# EAGLE schematic ACB-R1.0-43-CH09 (EAGLE 8.6.3)
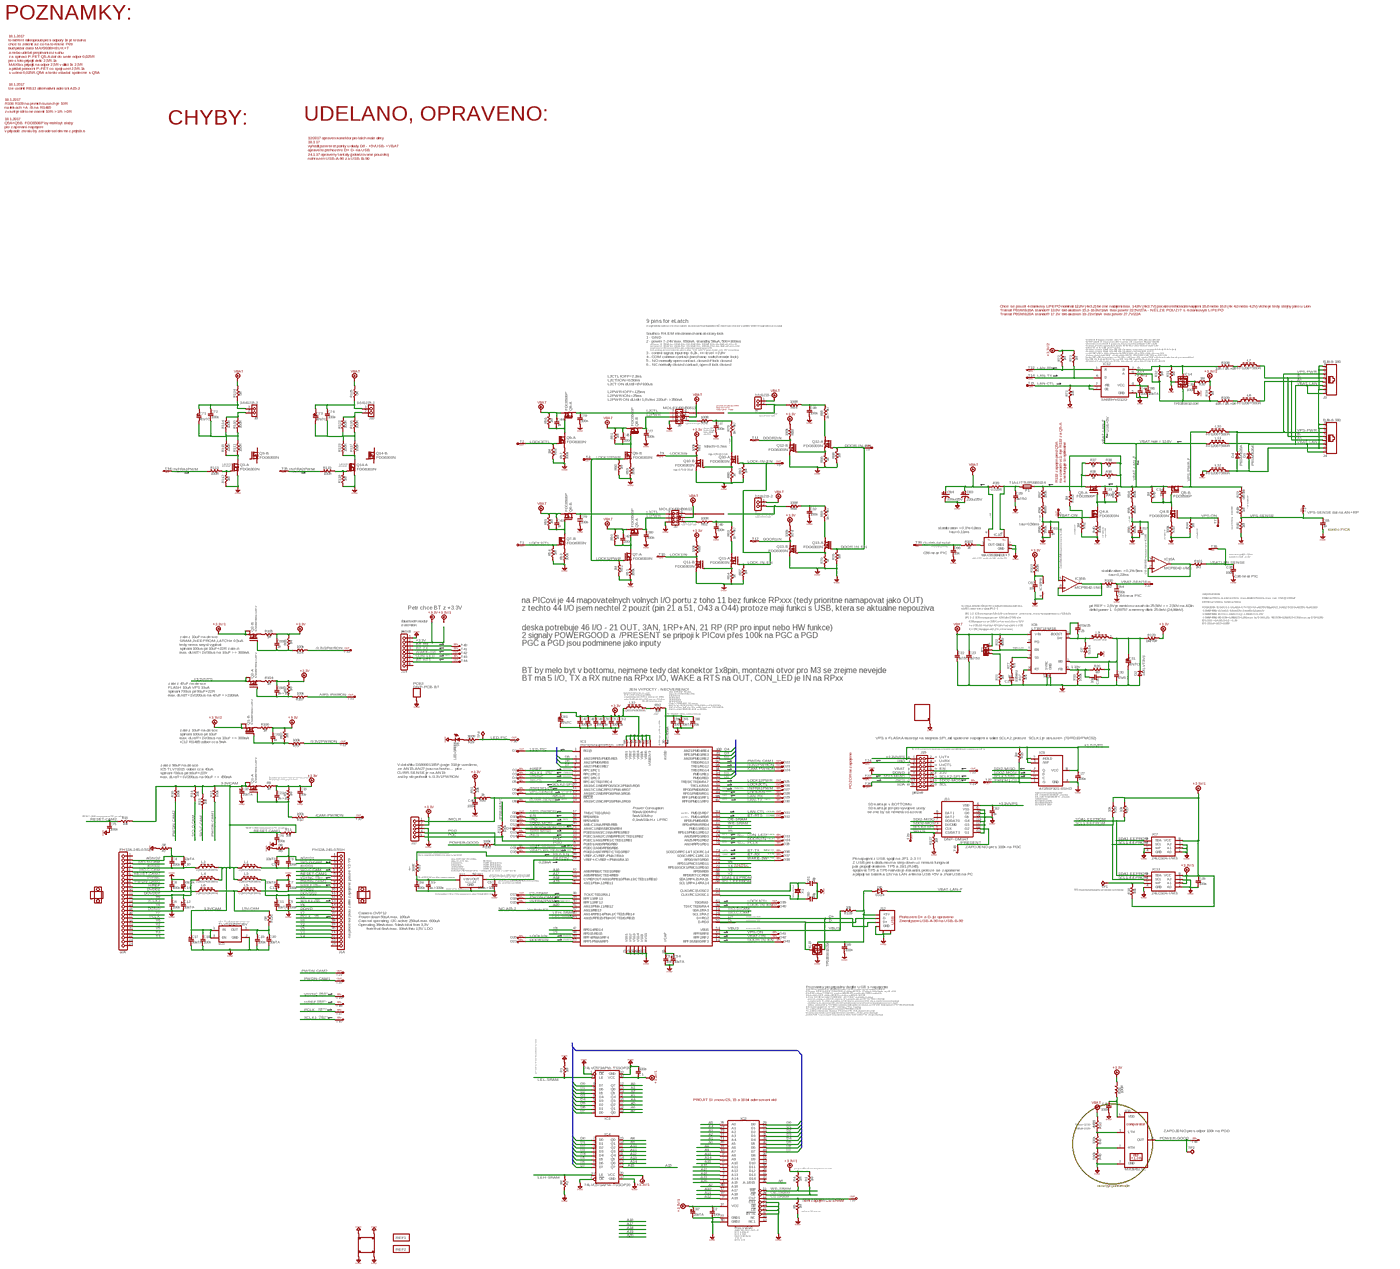
[diagram p0: schematic, sheet 1, overview]
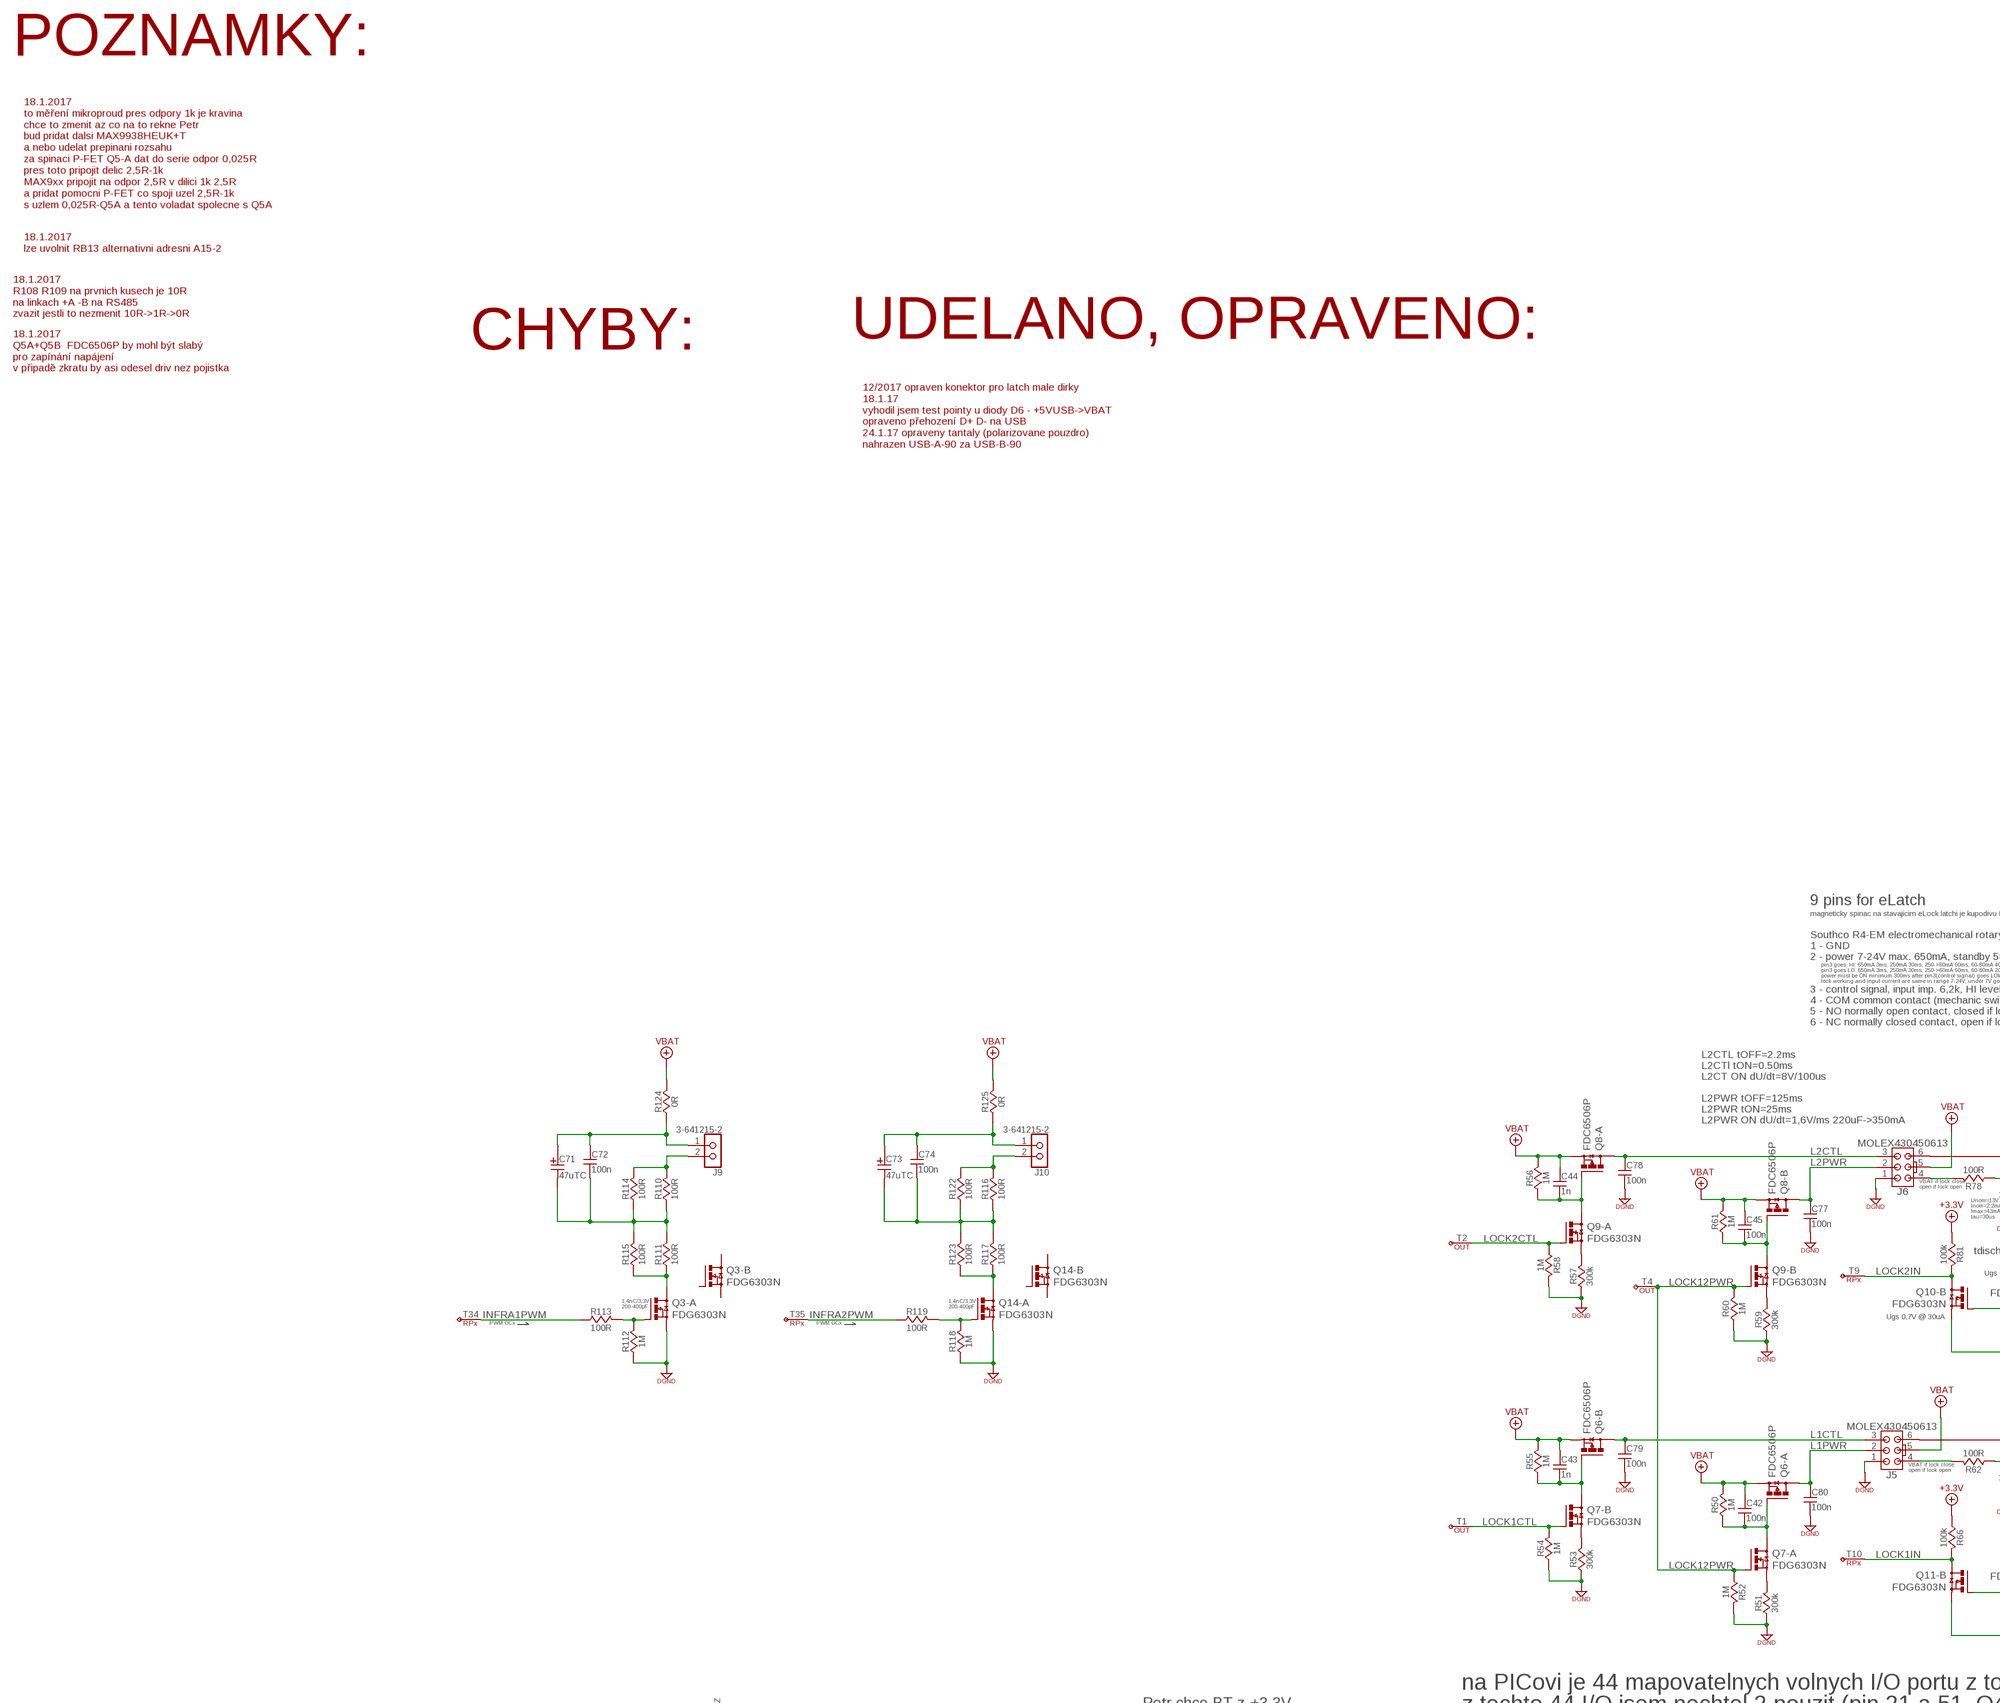
[diagram p1: schematic, sheet 1, part 1 of 4]
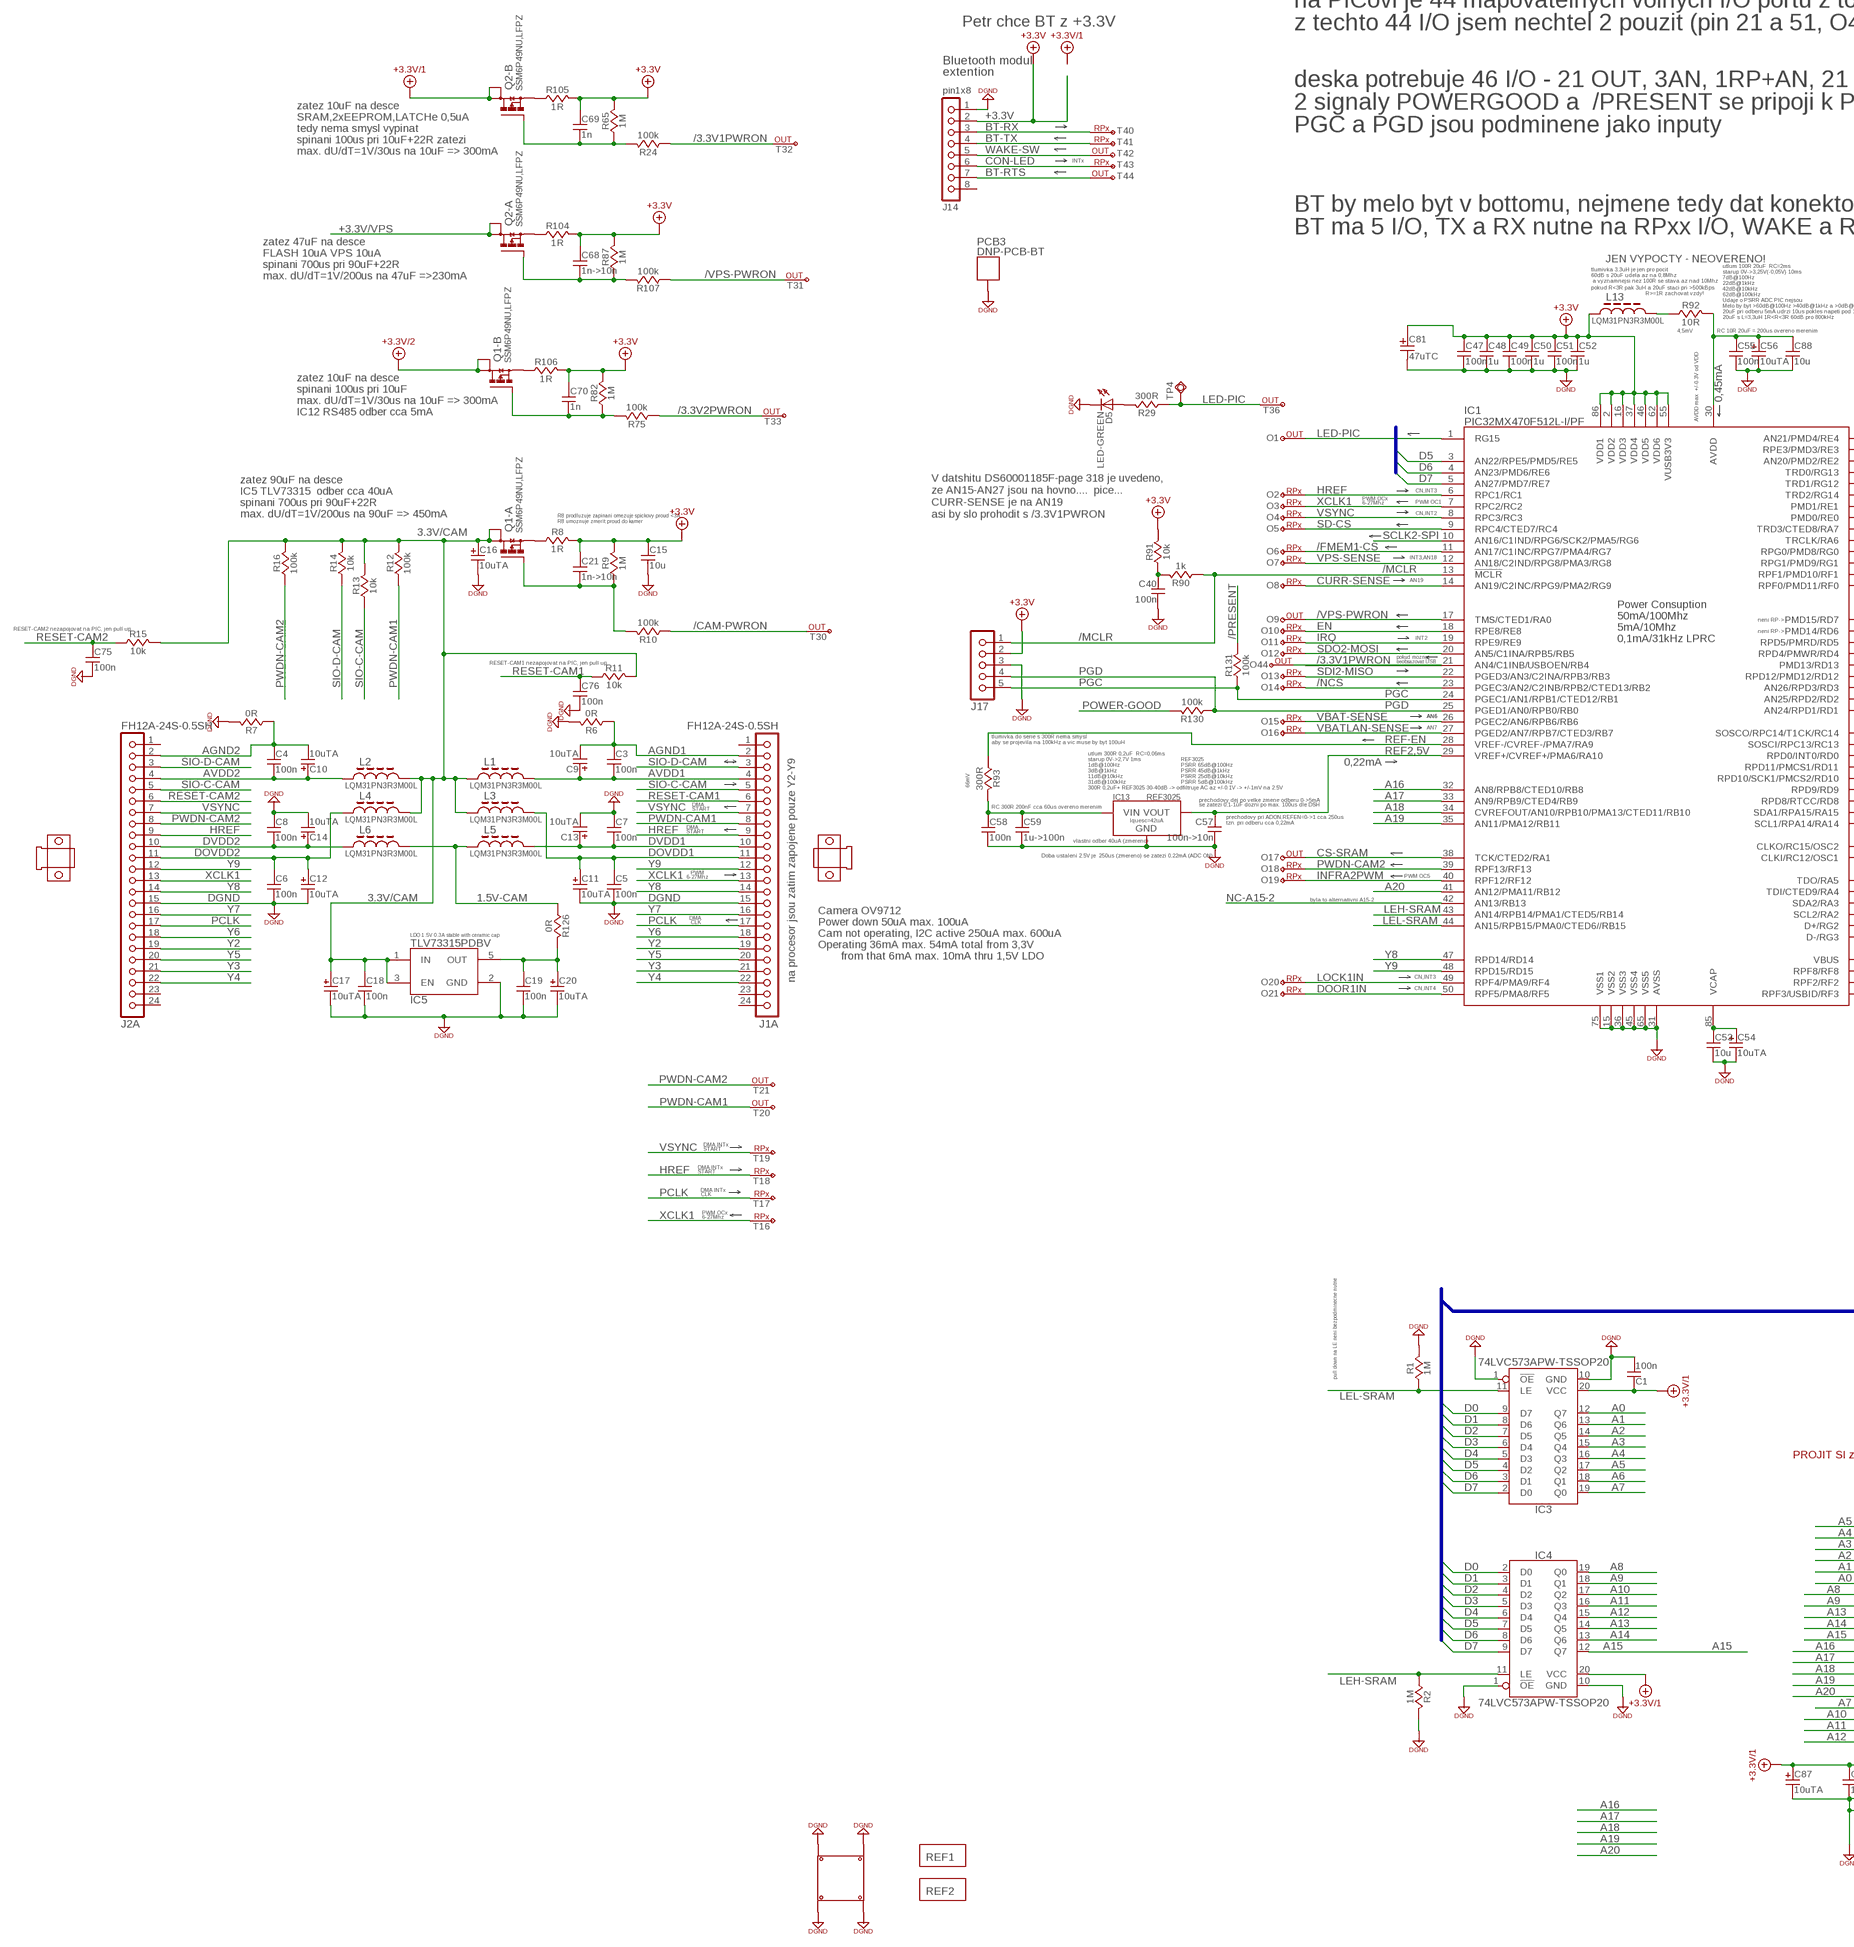
[diagram p2: schematic, sheet 1, part 2 of 4]
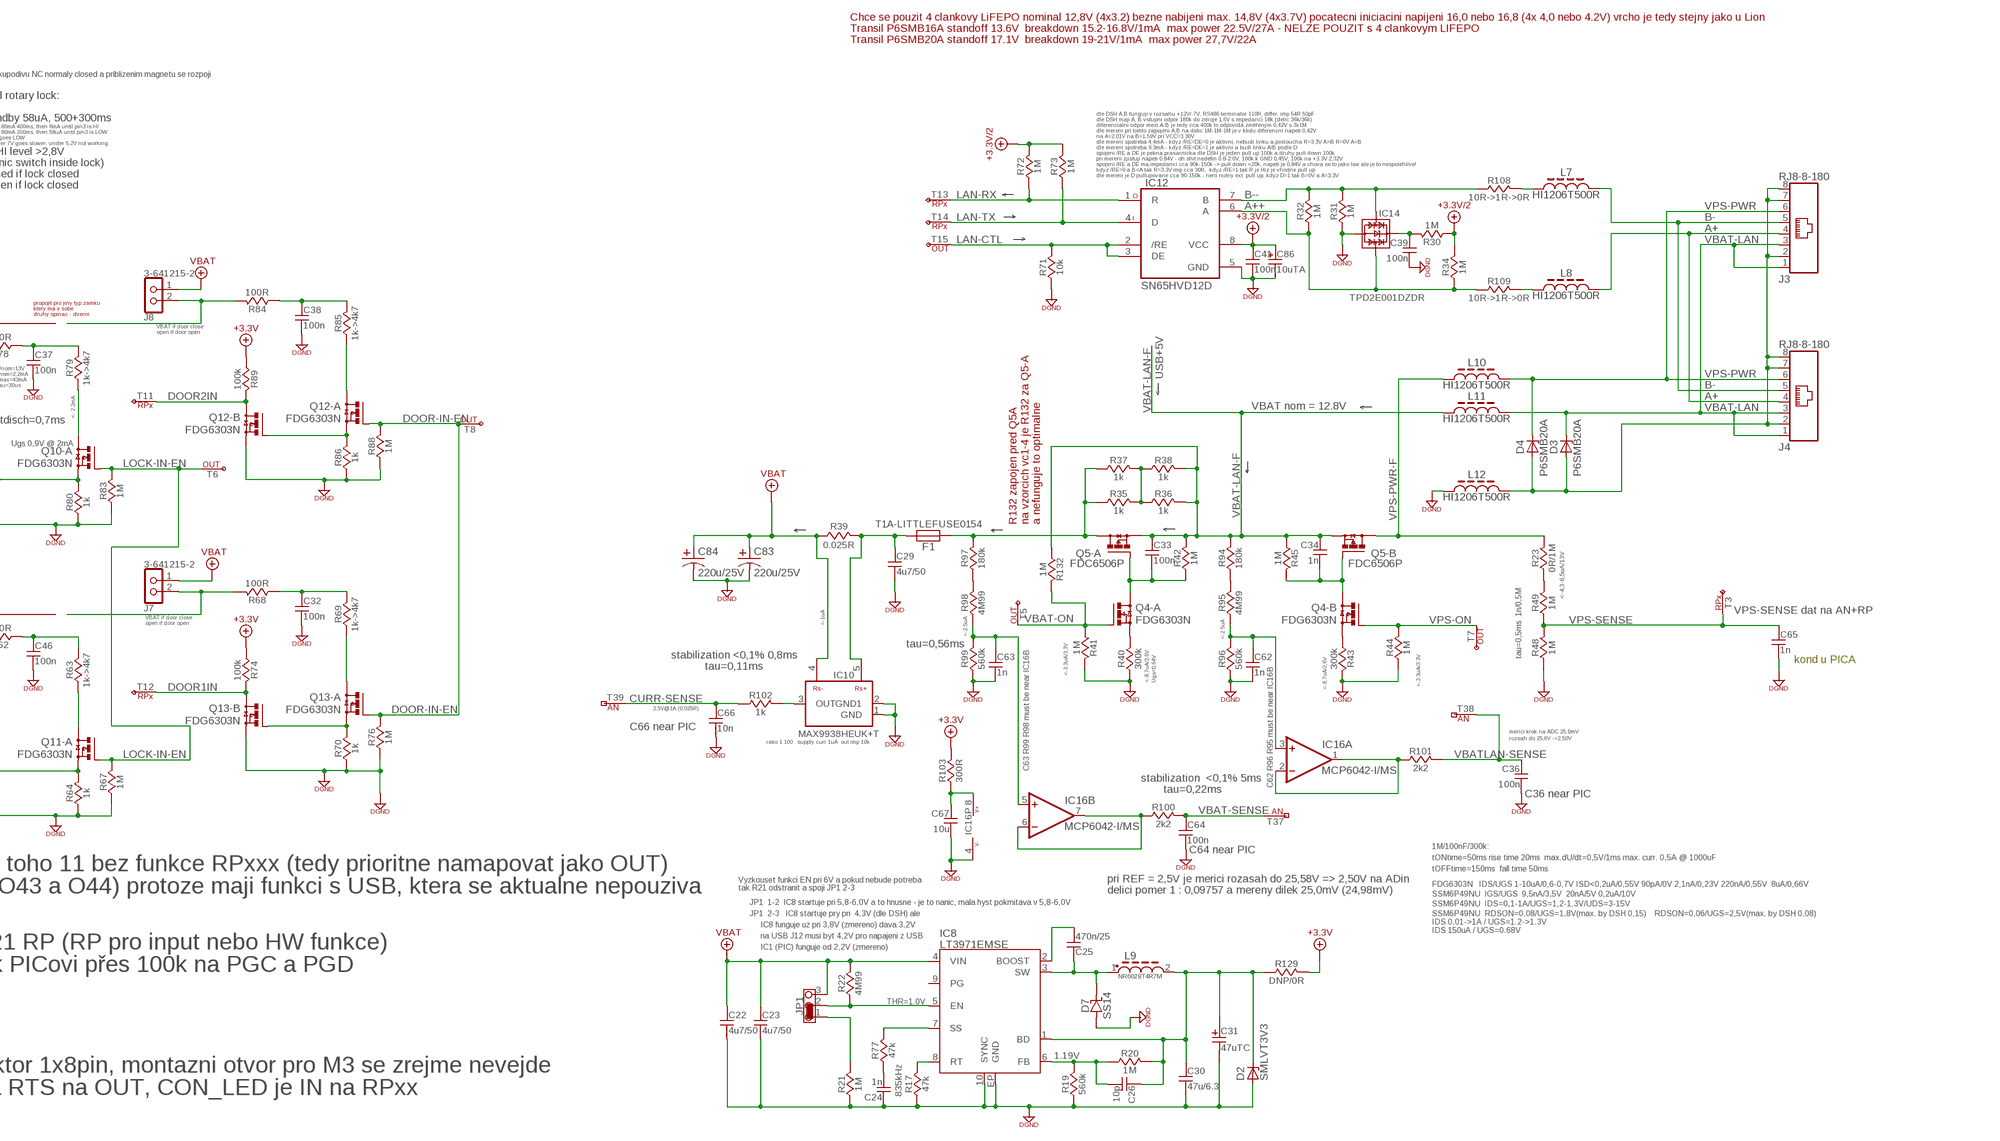
[diagram p3: schematic, sheet 1, part 3 of 4]
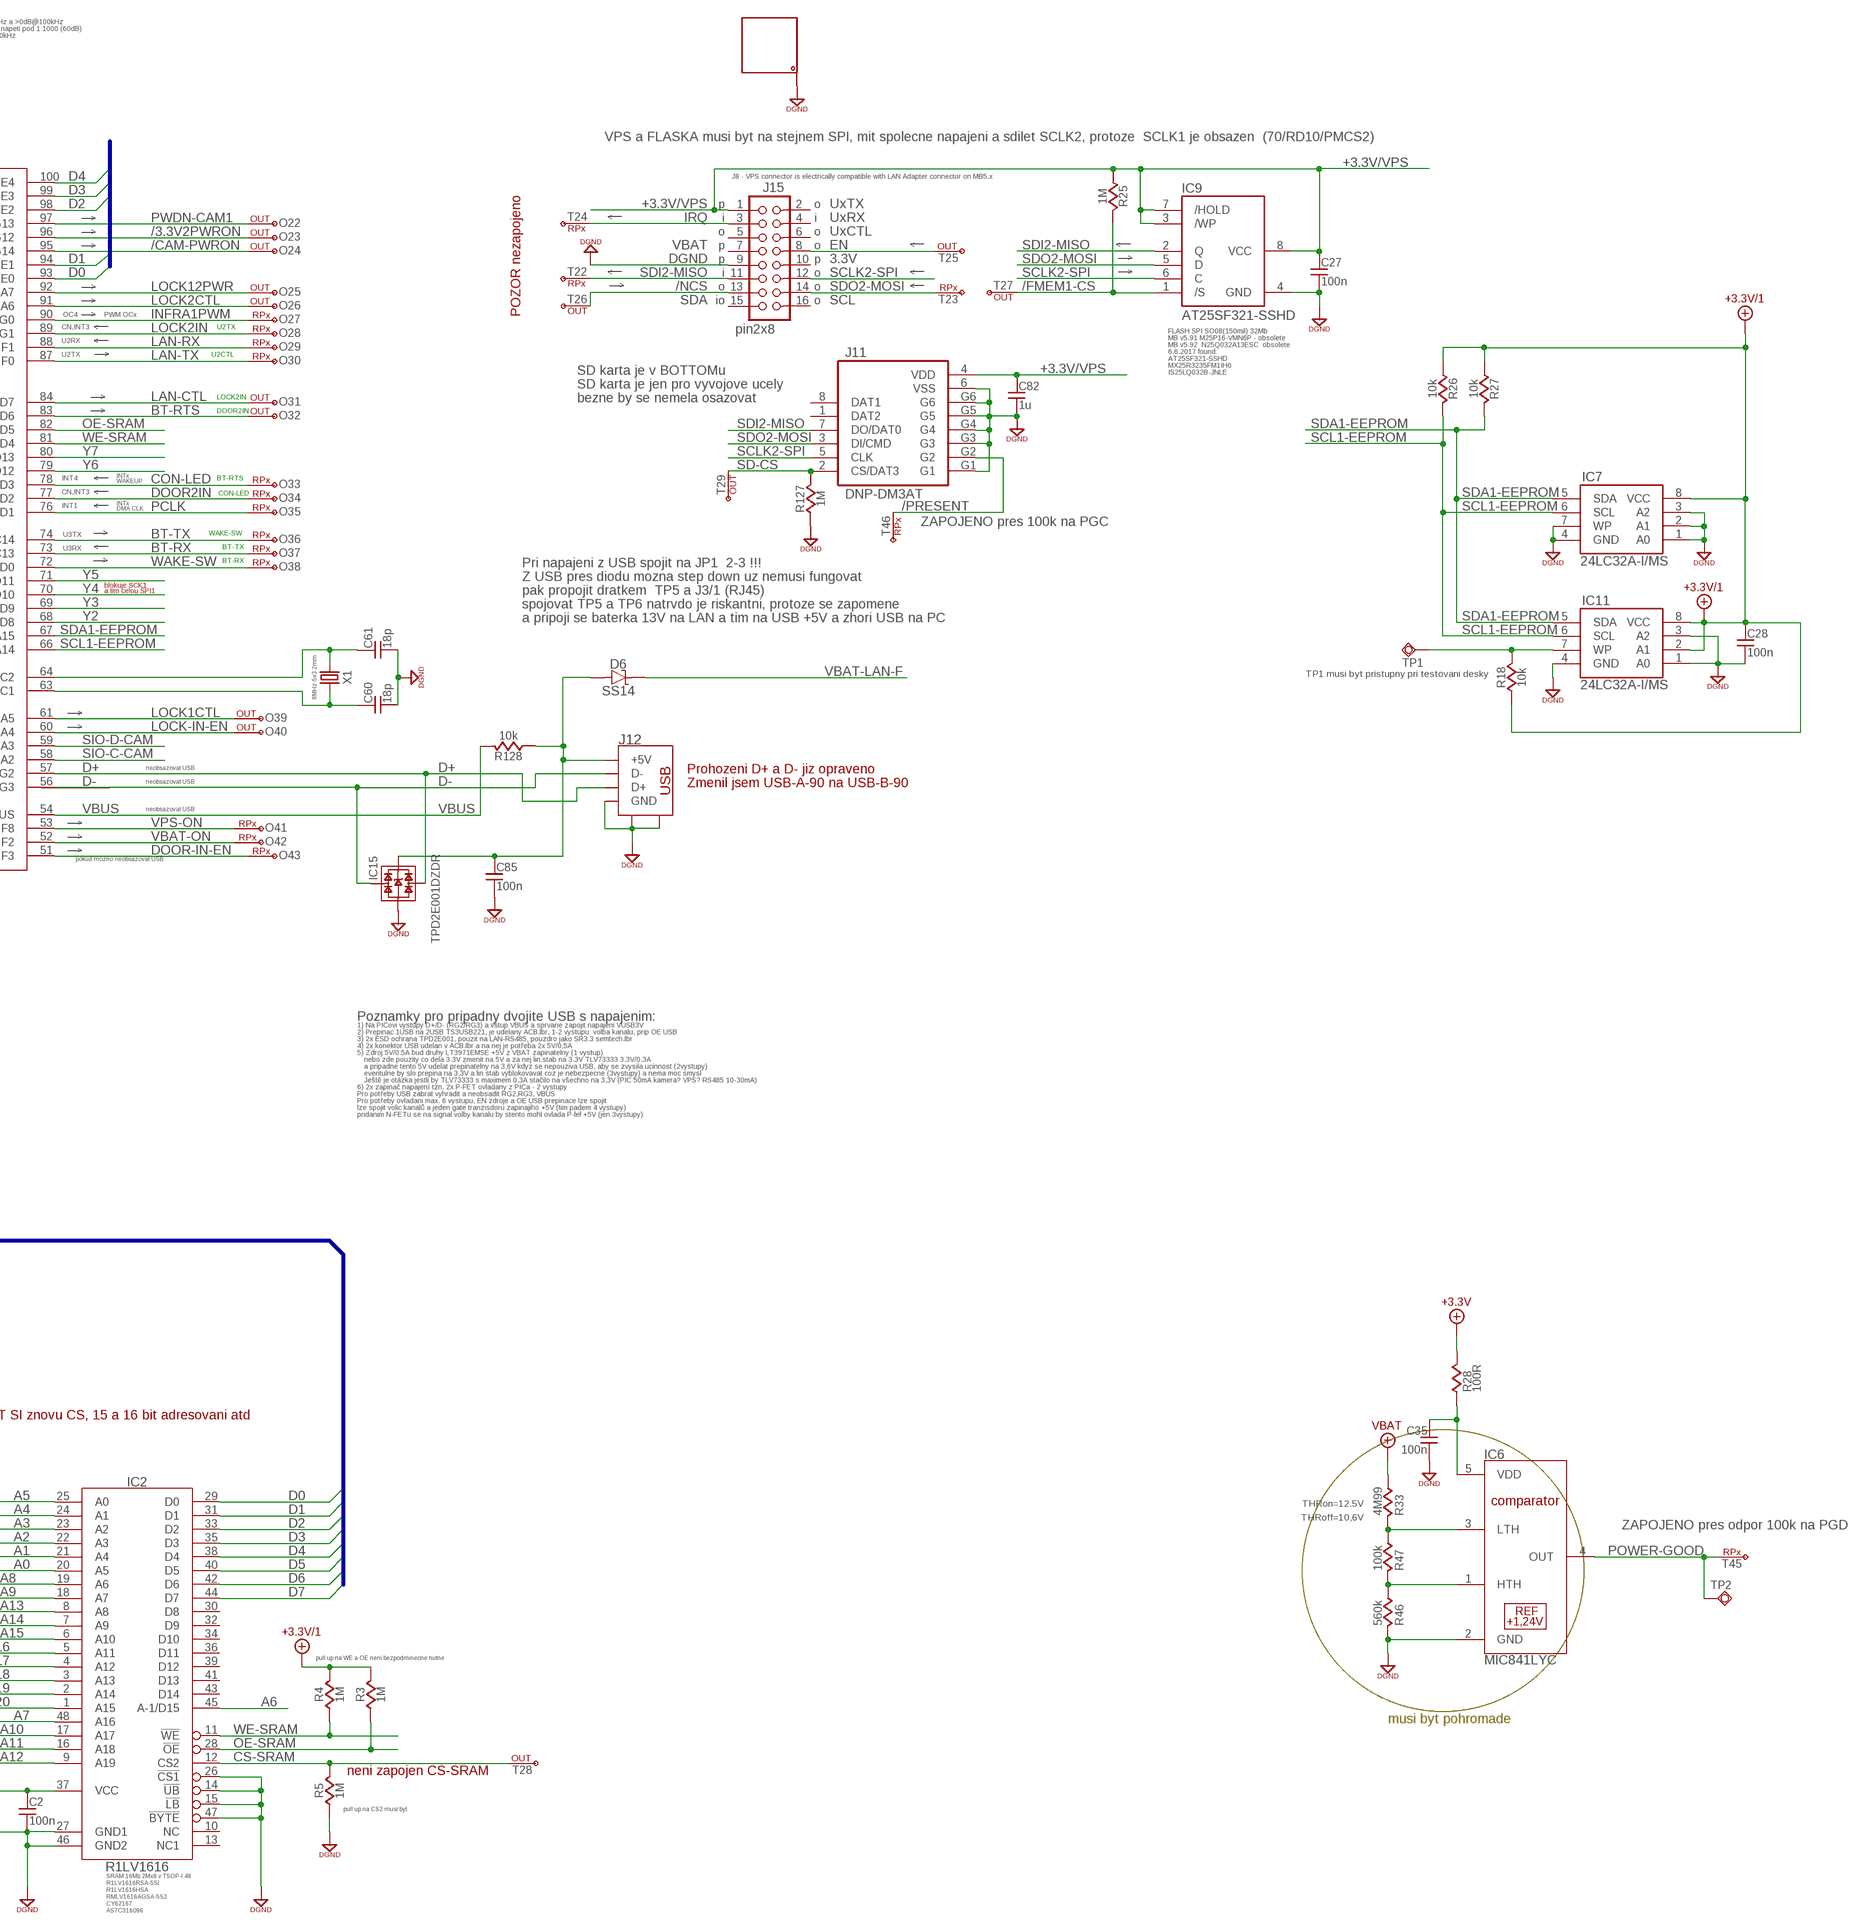
[diagram p4: schematic, sheet 1, part 4 of 4]

## Parts
C1  100n  C-0603  [0603]
C2  100n  C-0603  [0603]
C3  100n  C-0603  [0603]
C4  100n  C-0603  [0603]
C5  100n  C-0603  [0603]
C6  100n  C-0603  [0603]
C7  100n  C-0603  [0603]
C8  100n  C-0603  [0603]
C9  10uTA  CT-1206  [1206-POL-C]
C10  10uTA  CT-1206  [1206-POL-C]
C11  10uTA  CT-1206  [1206-POL-C]
C12  10uTA  CT-1206  [1206-POL-C]
C13  10uTA  CT-1206  [1206-POL-C]
C14  10uTA  CT-1206  [1206-POL-C]
C15  10u  C-0603  [0603]
C16  10uTA  CT-1206  [1206-POL-C]
C17  10uTA  CT-1206  [1206-POL-C]
C18  100n  C-0603  [0603]
C19  100n  C-0603  [0603]
C20  10uTA  CT-1206  [1206-POL-C]
C21  1n->10n  C-0603  [0603]
C22  4u7/50  C-1206  [1206]
C23  4u7/50  C-1206  [1206]
C24  1n  C-0603  [0603]
C25  470n/25  C-0603  [0603]
C26  10p  C-0603  [0603]
C27  100n  C-0603  [0603]
C28  100n  C-0603  [0603]
C29  4u7/50  C-1206  [1206]
C30  47u/6.3  C-1206  [1206]
C31  47uTC  CT-C  [CT-C]
C32  100n  C-0603  [0603]
C33  100n  C-0603  [0603]
C34  1n  C-0603  [0603]
C35  100n  C-0603  [0603]
C36  100n  C-0603  [0603]
C37  100n  C-0603  [0603]
C38  100n  C-0603  [0603]
C39  100n  C-0603  [0603]
C40  100n  C-0603  [0603]
C41  100n  C-0603  [0603]
C42  100n  C-0603  [0603]
C43  1n  C-0603  [0603]
C44  1n  C-0603  [0603]
C45  100n  C-0603  [0603]
C46  100n  C-0603  [0603]
C47  100n  C-0603  [0603]
C48  1u  C-0603  [0603]
C49  100n  C-0603  [0603]
C50  1u  C-0603  [0603]
C51  100n  C-0603  [0603]
C52  1u  C-0603  [0603]
C53  10u  C-0603  [0603]
C54  10uTA  CT-1206  [1206-POL-C]
C55  100n  C-0603  [0603]
C56  10uTA  CT-1206  [1206-POL-C]
C57  100n->10n  C-0603  [0603]
C58  100n  C-0603  [0603]
C59  1u->100n  C-0603  [0603]
C60  18p  C-0603  [0603]
C61  18p  C-0603  [0603]
C62  1n  C-0603  [0603]
C63  1n  C-0603  [0603]
C64  100n  C-0603  [0603]
C65  1n  C-0603  [0603]
C66  10n  C-0603  [0603]
C67  10u  C-0603  [0603]
C68  1n->10n  C-0603  [0603]
C69  1n  C-0603  [0603]
C70  1n  C-0603  [0603]
C71  47uTC  CT-C  [CT-C]
C72  100n  C-0603  [0603]
C73  47uTC  CT-C  [CT-C]
C74  100n  C-0603  [0603]
C75  100n  C-0603  [0603]
C76  100n  C-0603  [0603]
C77  100n  C-0603  [0603]
C78  100n  C-0603  [0603]
C79  100n  C-0603  [0603]
C80  100n  C-0603  [0603]
C81  47uTC  CT-C  [CT-C]
C82  1u  C-0603  [0603]
C83  220u/25V  CAP-ELEC-SMD-8MM  [CAP_8MM_DIA_SMT]
C84  220u/25V  CAP-ELEC-SMD-8MM  [CAP_8MM_DIA_SMT]
C85  100n  C-0603  [0603]
C86  10uTA  CT-1206  [1206-POL-C]
C87  10uTA  CT-1206  [1206-POL-C]
C88  10u  C-0603  [0603]
D2  SMLVT3V3  [SMA]
D3  P6SMB20A  P6SMB  [SMB]
D4  P6SMB20A  P6SMB  [SMB]
D5  LED-GREEN  LED-0805  [0805-POL-D]
D6  SS14  DS-SMA  [SMA]
D7  SS14  DS-SMA  [SMA]
F1  T1A-LITTLEFUSE0154  POJISTKA-LITTLEFUSE0154  [LITTLEFUSE0154]
H1  CAM-HOLDER  [CAM-HOLDER]
H2  CAM-HOLDER  [CAM-HOLDER]
IC1  PIC32MX470F512L-I/PF  [TQFP100_14X14_0,5MM]
IC2  R1LV1616  R1LV1616HSA  [48-TSOP-I]
IC3  74LVC573APW-TSSOP20  [TSSOP20]
IC4  74LVC573APW-TSSOP20  [TSSOP20]
IC5  TLV73315PDBV  [SOT23-5]
IC6  MIC841LYC  [SC-70-5]
IC7  24LC32A-I/MS  24-I/MS  [MSOP-08]
IC8  LT3971EMSE  [MSOP10EXP]
IC9  AT25SF321-SSHD  M25P16-VMN6P  [SO-08]
IC10  MAX9938HEUK+T  TSM9938HEUK+T  [SOT23-5]
IC11  24LC32A-I/MS  24-I/MS  [MSOP-08]
IC12  SN65HVD12D  SN65HVD3082ED  [SO08]
IC13  REF3025  [SOT23]
IC14  TPD2E001DZDR  SR05.TCT  [SOT-143]
IC15  TPD2E001DZDR  SR05.TCT  [SOT-143]
IC16  MCP6042-I/MS  [MSOP-08]
J1  FH12A-24S-0.5SH  [FH12A-24S-05SH]
J2  FH12A-24S-0.5SH  [FH12A-24S-05SH]
J3  RJ8-8-180  [RJ8-8-180]
J4  RJ8-8-180  [RJ8-8-180]
J5  MOLEX430450613  [MOLEX430450613]
J6  MOLEX430450613  [MOLEX430450613]
J7  3-641215-2  [3-641215-2]
J8  3-641215-2  [3-641215-2]
J9  3-641215-2  [3-641215-2]
J10  3-641215-2  [3-641215-2]
J11  DNP-DM3AT  DM3AT  [DM3AT]
J12  USB_A_180  USB_B_180  [USB_B_180]
J14  pin1x8  MA08-1-M  [MA08-1-MALE]
J15  pin2x8  MA08-2  [MA08-2]
J17  DNP-open-hole  MA05-1  [MA05-1]
JP1  JP3CLOSE12  [JP3CLOSE12]
L1  LQM31PN3R3M00L  L-1206  [1206]
L2  LQM31PN3R3M00L  L-1206  [1206]
L3  LQM31PN3R3M00L  L-1206  [1206]
L4  LQM31PN3R3M00L  L-1206  [1206]
L5  LQM31PN3R3M00L  L-1206  [1206]
L6  LQM31PN3R3M00L  L-1206  [1206]
L7  HI1206T500R  L-1206  [1206]
L8  HI1206T500R  L-1206  [1206]
L9  NR6028T4R7M  NR6028  [NR6028]
L10  HI1206T500R  L-1206  [1206]
L11  HI1206T500R  L-1206  [1206]
L12  HI1206T500R  L-1206  [1206]
L13  LQM31PN3R3M00L  L-1206  [1206]
O1  PIC-OUT  [TEMP-PAD]
O2  PIC-RPX  [TEMP-PAD]
O3  PIC-RPX  [TEMP-PAD]
O4  PIC-RPX  [TEMP-PAD]
O5  PIC-RPX  [TEMP-PAD]
O6  PIC-RPX  [TEMP-PAD]
O7  PIC-RPX  [TEMP-PAD]
O8  PIC-RPX  [TEMP-PAD]
O9  PIC-OUT  [TEMP-PAD]
O10  PIC-RPX  [TEMP-PAD]
O11  PIC-RPX  [TEMP-PAD]
O12  PIC-RPX  [TEMP-PAD]
O13  PIC-RPX  [TEMP-PAD]
O14  PIC-RPX  [TEMP-PAD]
O15  PIC-RPX  [TEMP-PAD]
O16  PIC-RPX  [TEMP-PAD]
O17  PIC-OUT  [TEMP-PAD]
O18  PIC-RPX  [TEMP-PAD]
O19  PIC-RPX  [TEMP-PAD]
O20  PIC-RPX  [TEMP-PAD]
O21  PIC-RPX  [TEMP-PAD]
O22  PIC-OUT  [TEMP-PAD]
O23  PIC-OUT  [TEMP-PAD]
O24  PIC-OUT  [TEMP-PAD]
O25  PIC-OUT  [TEMP-PAD]
O26  PIC-OUT  [TEMP-PAD]
O27  PIC-RPX  [TEMP-PAD]
O28  PIC-RPX  [TEMP-PAD]
O29  PIC-RPX  [TEMP-PAD]
O30  PIC-RPX  [TEMP-PAD]
O31  PIC-OUT  [TEMP-PAD]
O32  PIC-OUT  [TEMP-PAD]
O33  PIC-RPX  [TEMP-PAD]
O34  PIC-RPX  [TEMP-PAD]
O35  PIC-RPX  [TEMP-PAD]
O36  PIC-RPX  [TEMP-PAD]
O37  PIC-RPX  [TEMP-PAD]
O38  PIC-RPX  [TEMP-PAD]
O39  PIC-OUT  [TEMP-PAD]
O40  PIC-OUT  [TEMP-PAD]
O41  PIC-RPX  [TEMP-PAD]
O42  PIC-RPX  [TEMP-PAD]
O43  PIC-RPX  [TEMP-PAD]
O44  PIC-OUT  [TEMP-PAD]
PCB1  PCB-ACB  PCB-ACB-1  [PCB-ACB]
PCB2  DNP-PCB-VPS  PCB-VPS-1  [PCB-VPS]
PCB3  DNP-PCB-BT  BT_PCBBRD  [BT_MODULE_BRD]
Q1  SSM6P49NU,LFPZ  [MICRO_FET]
Q2  SSM6P49NU,LFPZ  [MICRO_FET]
Q3  FDG6303N  [SC70-6]
Q4  FDG6303N  [SC70-6]
Q5  FDC6506P  FDC6506D  [SSOT-6]
Q6  FDC6506P  FDC6506D  [SSOT-6]
Q7  FDG6303N  [SC70-6]
Q8  FDC6506P  FDC6506D  [SSOT-6]
Q9  FDG6303N  [SC70-6]
Q10  FDG6303N  [SC70-6]
Q11  FDG6303N  [SC70-6]
Q12  FDG6303N  [SC70-6]
Q13  FDG6303N  [SC70-6]
Q14  FDG6303N  [SC70-6]
R1  1M  R-0603  [0603]
R2  1M  R-0603  [0603]
R3  1M  R-0603  [0603]
R4  1M  R-0603  [0603]
R5  1M  R-0603  [0603]
R6  0R  R-0603  [0603]
R7  0R  R-0603  [0603]
R8  1R  R-0805  [0805]
R9  1M  R-0603  [0603]
R10  100k  R-0603  [0603]
R11  10k  R-0603  [0603]
R12  100k  R-0603  [0603]
R13  10k  R-0603  [0603]
R14  10k  R-0603  [0603]
R15  10k  R-0603  [0603]
R16  100k  R-0603  [0603]
R17  47k  R-0603  [0603]
R18  10k  R-0603  [0603]
R19  560k  R-0603  [0603]
R20  1M  R-0603  [0603]
R21  1M  R-0603  [0603]
R22  4M99  R-0603  [0603]
R23  0R/1M  R-0603  [0603]
R24  100k  R-0603  [0603]
R25  1M  R-0603  [0603]
R26  10k  R-0603  [0603]
R27  10k  R-0603  [0603]
R28  100R  R-0603  [0603]
R29  300R  R-0603  [0603]
R30  1M  R-0603  [0603]
R31  1M  R-0603  [0603]
R32  1M  R-0603  [0603]
R33  4M99  R-0603  [0603]
R34  1M  R-0603  [0603]
R35  1k  R-0805  [0805]
R36  1k  R-0805  [0805]
R37  1k  R-0805  [0805]
R38  1k  R-0805  [0805]
R39  0.025R  R-0805  [0805]
R40  300k  R-0603  [0603]
R41  1M  R-0603  [0603]
R42  1M  R-0603  [0603]
R43  300k  R-0603  [0603]
R44  1M  R-0603  [0603]
R45  1M  R-0603  [0603]
R46  560k  R-0603  [0603]
R47  100k  R-0603  [0603]
R48  1M  R-0603  [0603]
R49  1M  R-0603  [0603]
R50  1M  R-0603  [0603]
R51  300k  R-0603  [0603]
R52  1M  R-0603  [0603]
R53  300k  R-0603  [0603]
R54  1M  R-0603  [0603]
R55  1M  R-0603  [0603]
R56  1M  R-0603  [0603]
R57  300k  R-0603  [0603]
R58  1M  R-0603  [0603]
R59  300k  R-0603  [0603]
R60  1M  R-0603  [0603]
R61  1M  R-0603  [0603]
R62  100R  R-0603  [0603]
R63  1k->4k7  R-0603  [0603]
R64  1k  R-0603  [0603]
R65  1M  R-0603  [0603]
R66  100k  R-0603  [0603]
R67  1M  R-0603  [0603]
R68  100R  R-0603  [0603]
R69  1k->4k7  R-0603  [0603]
R70  1k  R-0603  [0603]
R71  10k  R-0603  [0603]
R72  1M  R-0603  [0603]
R73  1M  R-0603  [0603]
R74  100k  R-0603  [0603]
R75  100k  R-0603  [0603]
R76  1M  R-0603  [0603]
R77  47k  R-0603  [0603]
R78  100R  R-0603  [0603]
R79  1k->4k7  R-0603  [0603]
R80  1k  R-0603  [0603]
R81  100k  R-0603  [0603]
R82  1M  R-0603  [0603]
R83  1M  R-0603  [0603]
R84  100R  R-0603  [0603]
R85  1k->4k7  R-0603  [0603]
R86  1k  R-0603  [0603]
R87  1M  R-0603  [0603]
R88  1M  R-0603  [0603]
R89  100k  R-0603  [0603]
R90  1k  R-0603  [0603]
R91  10k  R-0603  [0603]
R92  10R  R-0603  [0603]
R93  300R  R-0603  [0603]
R94  180k  R-0603  [0603]
R95  4M99  R-0603  [0603]
R96  560k  R-0603  [0603]
R97  180k  R-0603  [0603]
R98  4M99  R-0603  [0603]
R99  560k  R-0603  [0603]
R100  2k2  R-0603  [0603]
R101  2k2  R-0603  [0603]
R102  1k  R-0603  [0603]
R103  300R  R-0603  [0603]
R104  1R  R-0805  [0805]
R105  1R  R-0805  [0805]
R106  1R  R-0805  [0805]
R107  100k  R-0603  [0603]
R108  10R->1R->0R  R-0603  [0603]
R109  10R->1R->0R  R-0603  [0603]
R110  100R  R-0603  [0603]
R111  100R  R-0603  [0603]
R112  1M  R-0603  [0603]
R113  100R  R-0603  [0603]
R114  100R  R-0603  [0603]
R115  100R  R-0603  [0603]
R116  100R  R-0603  [0603]
R117  100R  R-0603  [0603]
R118  1M  R-0603  [0603]
R119  100R  R-0603  [0603]
R122  100R  R-0603  [0603]
R123  100R  R-0603  [0603]
R124  0R  R-0603  [0603]
R125  0R  R-0603  [0603]
R126  0R  R-0603  [0603]
R127  1M  R-0603  [0603]
R128  10k  R-0603  [0603]
R129  DNP/0R  R-0603  [0603]
R130  100k  R-0603  [0603]
R131  100k  R-0603  [0603]
R132  1M  R-0603  [0603]
REF1  REF  [REF]
REF2  REF  [REF]
T1  PIC-OUT  [TEMP-PAD]
T2  PIC-OUT  [TEMP-PAD]
T3  PIC-RPX  [TEMP-PAD]
T4  PIC-OUT  [TEMP-PAD]
T5  PIC-OUT  [TEMP-PAD]
T6  PIC-OUT  [TEMP-PAD]
T7  PIC-OUT  [TEMP-PAD]
T8  PIC-OUT  [TEMP-PAD]
T9  PIC-RPX  [TEMP-PAD]
T10  PIC-RPX  [TEMP-PAD]
T11  PIC-RPX  [TEMP-PAD]
T12  PIC-RPX  [TEMP-PAD]
T13  PIC-RPX  [TEMP-PAD]
T14  PIC-RPX  [TEMP-PAD]
T15  PIC-OUT  [TEMP-PAD]
T16  PIC-RPX  [TEMP-PAD]
T17  PIC-RPX  [TEMP-PAD]
T18  PIC-RPX  [TEMP-PAD]
T19  PIC-RPX  [TEMP-PAD]
T20  PIC-OUT  [TEMP-PAD]
T21  PIC-OUT  [TEMP-PAD]
T22  PIC-RPX  [TEMP-PAD]
T23  PIC-RPX  [TEMP-PAD]
T24  PIC-RPX  [TEMP-PAD]
T25  PIC-OUT  [TEMP-PAD]
T26  PIC-OUT  [TEMP-PAD]
T27  PIC-OUT  [TEMP-PAD]
T28  PIC-OUT  [TEMP-PAD]
T29  PIC-OUT  [TEMP-PAD]
T30  PIC-OUT  [TEMP-PAD]
T31  PIC-OUT  [TEMP-PAD]
T32  PIC-OUT  [TEMP-PAD]
T33  PIC-OUT  [TEMP-PAD]
T34  PIC-RPX  [TEMP-PAD]
T35  PIC-RPX  [TEMP-PAD]
T36  PIC-OUT  [TEMP-PAD]
T37  PIN-AN  [TEMP-PAD]
T38  PIN-AN  [TEMP-PAD]
T39  PIN-AN  [TEMP-PAD]
T40  PIC-RPX  [TEMP-PAD]
T41  PIC-RPX  [TEMP-PAD]
T42  PIC-OUT  [TEMP-PAD]
T43  PIC-RPX  [TEMP-PAD]
T44  PIC-OUT  [TEMP-PAD]
T45  PIC-RPX  [TEMP-PAD]
T46  PIC-RPX  [TEMP-PAD]
TP1  DNP-TestPoint  ROUND_SMD1MM  [SMD_ROUND_1MM]
TP2  DNP-TestPoint  ROUND_SMDTH1.4MM  [TH_ROUND_14MM08MM]
TP4  DNP-TestPoint  ROUND_SMDTH1.4MM  [TH_ROUND_14MM08MM]
X1  8MHz-5x3.2mm  XTAL-7B  [7B]

## Nets
1.5V-CAM: L5.1 L6.2 R126.1
1.5V-CAM-OUT: C19.1 C20.+ IC5.5(OUT) R126.2
3.3V/CAM: C16.+ C17.+ C18.1 IC5.1(IN) IC5.3(EN) L1.1 L2.2 L3.1 L4.2 Q1.6(-A:D) Q1.P1(-A:D1) R11.2 R12.2 R13.2 R14.2 R15.2 R16.2
+3,3V-FILT: C35.1 IC6.5(VDD) R28.1
+3.3V: C15.1 C21.1 C47.1 C48.1 C49.1 C50.1 C51.1 C52.1 C68.1 C69.1 C70.1 C81.+ IC1.2(VDD2) IC1.16(VDD3) IC1.37(VDD4) IC1.46(VDD5) IC1.55(VUSB3V3) IC1.62(VDD6) IC1.86(VDD1) J14.2 J17.2 L13.1 R8.2 R9.2 R28.2 R65.1 R66.2 R74.2 R81.2 R82.1 R87.1 R89.2 R91.2 R103.2 R104.2 R105.2 R106.2 R129.1
+3.3V/1: C1.1 C2.1 C28.1 C87.+ IC2.37(VCC) IC3.20(VCC) IC4.20(VCC) IC7.8(VCC) IC11.2(A1) IC11.8(VCC) Q2.3(-B:D) Q2.P2(-B:D1) R3.2 R4.2 R18.1 R26.1 R27.1
+3.3V/2: C41.1 C86.+ IC12.8(VCC) Q1.3(-B:D) Q1.P2(-B:D1) R30.2 R34.1 R72.1 R73.2
+3.3V/VPS: C27.1 C82.1 IC9.3(/WP) IC9.7(/HOLD) IC9.8(VCC) J11.4(VDD) J15.1 Q2.6(-A:D) Q2.P1(-A:D1) R25.2
/3.3V1PWRON: IC1.21(AN4/C1INB/USBOEN/RB4) O44.P$1(TP) R24.2 T32.P$1(TP)
/3.3V2PWRON: IC1.96(TRD1/RG12) O23.P$1(TP) R75.2 T33.P$1(TP)
/CAM-PWRON: IC1.95(TRD2/RG14) O24.P$1(TP) R10.1 T30.P$1(TP)
/FMEM1-CS: IC1.11(AN17/C1INC/RPG7/PMA4/RG7) IC9.1(/S) O6.P$1(TP) R25.1 T27.P$1(TP)
/MCLR: IC1.13(!MCLR) J17.1 R90.2
/NCS: IC1.23(PGEC3/AN2/C2INB/RPB2/CTED13/RB2) J15.13 O14.P$1(TP) T26.P$1(TP)
/PRESENT: J11.G2 R131.2 T46.P$1(TP)
/VPS-PWRON: IC1.17(TMS/CTED1/RA0) O9.P$1(TP) R107.2 T31.P$1(TP)
A0: IC2.20(A5) IC3.12(Q7)
A1: IC2.21(A4) IC3.13(Q6)
A2: IC2.22(A3) IC3.14(Q5)
A3: IC2.23(A2) IC3.15(Q4)
A4: IC2.24(A1) IC3.16(Q3)
A5: IC2.25(A0) IC3.17(Q2)
A6: IC2.45(A-1/D15) IC3.18(Q1)
A7: IC2.48(A16) IC3.19(Q0)
A8: IC2.19(A6) IC4.19(Q0)
A9: IC2.18(A7) IC4.18(Q1)
A10: IC2.17(A17) IC4.17(Q2)
A11: IC2.16(A18) IC4.16(Q3)
A12: IC2.9(A19) IC4.15(Q4)
A13: IC2.8(A8) IC4.14(Q5)
A14: IC2.7(A9) IC4.13(Q6)
A15: IC2.6(A10) IC4.12(Q7)
A16: IC1.32(AN8/RPB8/CTED10/RB8) IC2.5(A11)
A17: IC1.33(AN9/RPB9/CTED4/RB9) IC2.4(A12)
A18: IC1.34(CVREFOUT/AN10/RPB10/PMA13/CTED11/RB10) IC2.3(A13)
A19: IC1.35(AN11/PMA12/RB11) IC2.2(A14)
A20: IC1.41(AN12/PMA11/RB12) IC2.1(A15)
A+ [HV]: J3.4 J4.4 L8.2
A++ [HV]: IC12.6(A) IC14.3 R32.2 R34.2 R109.2
AGND1: C3.1 C9.- J1.2 R6.1
AGND2: C4.1 C10.- J2.2 R7.1
AVDD: C55.1 C56.+ C88.1 IC1.30(AVDD) R92.2
AVDD1: C3.2 C9.+ J1.4 L1.2
AVDD2: C4.2 C10.+ J2.4 L2.1
B- [HV]: J3.5 J4.5 L7.2
B-- [HV]: IC12.7(B) IC14.2 R31.1 R32.1 R108.2
BT-RTS: IC1.83(PMD14/RD6) J14.7 O32.P$1(TP) T44.P$1(TP)
BT-RX: IC1.73(SOSCI/RPC13/RC13) J14.3 O37.P$1(TP) T40.P$1(TP)
BT-TX: IC1.74(SOSCO/RPC14/T1CK/RC14) J14.4 O36.P$1(TP) T41.P$1(TP)
CON-LED: IC1.78(AN26/RPD3/RD3) J14.6 O33.P$1(TP) T43.P$1(TP)
CS-SRAM: IC1.38(TCK/CTED2/RA1) IC2.12(CS2) O17.P$1(TP) R5.2 T28.P$1(TP)
CURR-SENSE: C66.1 IC1.14(AN19/C2INC/RPG9/PMA2/RG9) O8.P$1(TP) R102.2 T39.P$1(TP)
D0: IC1.93(PMD0/RE0) IC2.29(D0) IC3.9(D7) IC4.2(D0)
D1: IC1.94(PMD1/RE1) IC2.31(D1) IC3.8(D6) IC4.3(D1)
D2: IC1.98(AN20/PMD2/RE2) IC2.33(D2) IC3.7(D5) IC4.4(D2)
D3: IC1.99(RPE3/PMD3/RE3) IC2.35(D3) IC3.6(D4) IC4.5(D3)
D4: IC1.100(AN21/PMD4/RE4) IC2.38(D4) IC3.5(D3) IC4.6(D4)
D5: IC1.3(AN22/RPE5/PMD5/RE5) IC2.40(D5) IC3.4(D2) IC4.7(D5)
D6: IC1.4(AN23/PMD6/RE6) IC2.42(D6) IC3.3(D1) IC4.8(D6)
D7: IC1.5(AN27/PMD7/RE7) IC2.44(D7) IC3.2(D0) IC4.9(D7)
D+: IC1.57(D+/RG2) IC15.3 J12.3_D+(D+)
D-: IC1.56(D-/RG3) IC15.2 J12.2_D-(D-)
DGND [GND]: C1.2 C2.2 C5.2 C6.2 C7.1 C8.1 C11.- C12.- C13.- C14.- C15.2 C16.- C17.- C18.2 C19.2 C20.- C22.2 C23.2 C24.1 C27.2 C28.2 C29.2 C30.2 C31.- C32.2 C35.2 C36.2 C37.2 C38.2 C39.2 C40.2 C41.2 C46.2 C47.2 C48.2 C49.2 C50.2 C51.2 C52.2 C53.2 C54.- C55.2 C56.- C57.2 C58.2 C59.2 C60.2 C61.2 C62.2 C63.2 C64.2 C65.2 C66.2 C67.2 C75.2 C76.2 C77.2 C78.2 C79.2 C80.2 C81.- C82.2 C83.2 C84.2 C85.2 C86.- C87.- C88.2 D2.-(A) D5.K D7.A IC1.15(VSS2) IC1.31(AVSS) IC1.36(VSS3) IC1.45(VSS4) IC1.65(VSS5) IC1.75(VSS1) IC2.14(!UB) IC2.15(!LB) IC2.26(!CS1) IC2.27(GND1) IC2.46(GND2) IC2.47(!BYTE) IC3.1(!OE) IC3.10(GND) IC4.1(!OE) IC4.10(GND) IC5.2(GND) IC6.2(GND) IC7.1(A0) IC7.2(A1) IC7.3(A2) IC7.4(GND) IC7.7(WP) IC8.10(SYNC) IC8.EP(GND) IC9.4(GND) IC10.1(GND) IC10.2(GND1) IC11.1(A0) IC11.3(A2) IC11.4(GND) IC12.5(GND) IC13.3(GND) IC14.1 IC15.1 IC16.4(P:V-) J1.15 J2.15 J5.1 J6.1 J11.6(VSS) J11.G1 J11.G3 J11.G4 J11.G5 J11.G6 J12.4_GND(GND) J12.SH1(GND_SH1) J12.SH2(GND_SH2) J14.1 J15.9 J17.3 L12.1 PCB1.PAD_GND_1 PCB1.PAD_GND_2 PCB1.PAD_GND_3 PCB1.PAD_GND_4 PCB2.VPS_PCB_1 PCB3.1 Q3.1(-A:S) Q10.4(-B:S) Q11.4(-B:S) Q12.4(-B:S) Q13.4(-B:S) Q14.1(-A:S) R1.1 R2.1 R5.1 R6.2 R7.2 R17.2 R19.2 R21.2 R31.2 R40.1 R41.2 R43.1 R44.2 R46.1 R48.1 R51.1 R52.2 R53.2 R54.2 R57.1 R58.2 R59.2 R60.2 R64.2 R67.2 R70.2 R71.2 R76.2 R80.2 R83.2 R86.2 R88.2 R96.2 R99.2 R112.2 R118.2 R127.1
DGND-F [HV]: D3.A D4.A J3.2 J3.7 J3.8 J4.2 J4.7 J4.8 L12.2
DOOR1IN: IC1.50(RPF5/PMA8/RF5) O21.P$1(TP) Q13.3(-B:D) R74.1 T12.P$1(TP)
DOOR2IN: IC1.77(AN25/RPD2/RD2) O34.P$1(TP) Q12.3(-B:D) R89.1 T11.P$1(TP)
DOOR-IN-EN: IC1.51(RPF3/USBID/RF3) O43.P$1(TP) Q12.2(-A:G) Q13.2(-A:G) R76.1 R88.1 T8.P$1(TP)
DOVDD1: C5.1 C11.+ J1.11 L3.2
DOVDD2: C6.1 C12.+ J2.11 L4.1
DVDD1: C7.2 C13.+ J1.10 L5.2
DVDD2: C8.2 C14.+ J2.10 L6.1
EN: IC1.18(RPE8/RE8) J15.8 O10.P$1(TP) T25.P$1(TP)
GATE-Q12A: C33.2 Q4.6(-A:D) Q5.1(-A:G) R42.2
GATE-Q12B: C34.2 Q4.3(-B:D) Q5.3(-B:G) R45.2
HREF: IC1.6(RPC1/RC1) J1.9 J2.9 O2.P$1(TP) T18.P$1(TP)
INFRA1PWM: IC1.90(RPG0/PMD8/RG0) O27.P$1(TP) R113.2 T34.P$1(TP)
INFRA2PWM: IC1.40(RPF12/RF12) O19.P$1(TP) R119.2 T35.P$1(TP)
IRQ: IC1.19(RPE9/RE9) J15.3 O11.P$1(TP) T24.P$1(TP)
L1CTL [HV]: C79.1 J5.3 Q6.4(-B:D)
L1PWR [HV]: C80.1 J5.2 Q6.6(-A:D)
L2CTL: C78.1 J6.3 Q8.6(-A:D)
L2PWR: C77.1 J6.2 Q8.4(-B:D)
LAN-CTL: IC1.84(PMD15/RD7) IC12.2(/RE) IC12.3(DE) O31.P$1(TP) R71.1 T15.P$1(TP)
LAN-RX: IC1.88(RPF1/PMD10/RF1) IC12.1(R) O29.P$1(TP) R72.2 T13.P$1(TP)
LAN-TX: IC1.87(RPF0/PMD11/RF0) IC12.4(D) O30.P$1(TP) R73.1 T14.P$1(TP)
LED-PIC: IC1.1(RG15) O1.P$1(TP) R29.1 T36.P$1(TP) TP4.P$1(TP)
LEH-SRAM: IC1.43(AN14/RPB14/PMA1/CTED5/RB14) IC4.11(LE) R2.2
LEL-SRAM: IC1.44(AN15/RPB15/PMA0/CTED6//RB15) IC3.11(LE) R1.2
LOCK1CTL: IC1.61(TDO/RA5) O39.P$1(TP) Q7.5(-B:G) R54.1 T1.P$1(TP)
LOCK1IN: IC1.49(RPF4/PMA9/RF4) O20.P$1(TP) Q11.3(-B:D) R66.1 T10.P$1(TP)
LOCK2CTL: IC1.91(TRCLK/RA6) O26.P$1(TP) Q9.2(-A:G) R58.1 T2.P$1(TP)
LOCK2IN: IC1.89(RPG1/PMD9/RG1) O28.P$1(TP) Q10.3(-B:D) R81.1 T9.P$1(TP)
LOCK12PWR: IC1.92(TRD3/CTED8/RA7) O25.P$1(TP) Q7.2(-A:G) Q9.5(-B:G) R52.1 R60.1 T4.P$1(TP)
LOCK-IN-EN: IC1.60(TDI/CTED9/RA4) O40.P$1(TP) Q10.2(-A:G) Q11.2(-A:G) R67.1 R83.1 T6.P$1(TP)
N$1: Q1.1(-A:S) R8.1
N$2 [HV]: J5.4 R62.1
N$3: C21.2 Q1.2(-A:G) R9.1 R10.2
N$4: Q11.1(-A:S) Q11.5(-B:G) R64.1
N$5: Q11.6(-A:D) R63.2
N$6: Q12.1(-A:S) Q12.5(-B:G) R86.1
N$7: Q10.1(-A:S) Q10.5(-B:G) R80.1
N$8 [HV]: J7.2 R68.1
N$9 [GND]: Q13.1(-A:S) Q13.5(-B:G) R70.1
N$10: Q12.6(-A:D) R85.2
N$11 [HV]: Q13.6(-A:D) R69.2
N$12 [HV]: C32.1 R68.2 R69.1
N$13: IC11.7(WP) R18.2 TP1.P$1(TP)
N$14: D5.A R29.2
N$15: Q7.1(-A:S) R51.2
N$16: Q4.1(-A:S) R40.2
N$17: Q4.4(-B:S) R43.2
N$18: C39.1 IC14.4 R30.1
N$19: Q10.6(-A:D) R79.2
N$20 [HV]: R35.2 R36.1 R37.2 R38.1
N$21 [HV]: C29.1 F1.1 IC10.5(VIN+) R39.2
N$22: Q9.1(-A:S) R57.2
N$23: C42.2 Q6.1(-A:G) Q7.6(-A:D) R50.2
N$24: L13.2 R92.1
N$25: Q7.4(-B:S) R53.1
N$26 [HV]: J10.2 R116.1 R122.1
N$27: IC6.1(HTH) R46.2 R47.1
N$28: IC6.3(LTH) R33.1 R47.2
N$29: C44.2 Q8.1(-A:G) Q9.6(-A:D) R56.2
N$30: Q9.4(-B:S) R59.1
N$31: C43.2 Q6.3(-B:G) Q7.3(-B:D) R55.2
N$32: C61.1 IC1.64(CLKO/RC15/OSC2) X1.1
N$33: C45.2 Q8.3(-B:G) Q9.3(-B:D) R61.2
N$35: Q2.1(-A:S) R104.1
N$36: Q1.4(-B:S) R106.1
N$37 [HV]: C46.1 R62.2 R63.1
N$38 [HV]: F1.2 Q5.6(-A:D) R35.1 R37.1 R97.1
N$39: C60.1 IC1.63(CLKI/RC12/OSC1) X1.3
N$40: J6.4 R78.1
N$41 [HV]: C37.1 R78.2 R79.1
N$43 [HV]: J8.2 R84.1
N$44: C58.1 C59.1 IC13.1(VIN) R93.2
N$46 [HV]: C71.+ C72.1 J9.1 R124.2
N$47 [HV]: C73.+ C74.1 J10.1 R125.2
N$48: R94.2 R95.1
N$49: C62.1 IC16.3(A:+IN) R95.2 R96.1
N$50: C26.2 IC8.6(FB) R19.1 R20.2
N$51: C24.2 R77.2
N$52 [HV]: C25.1 D7.K IC8.3(SW) L9.1
N$53: IC8.8(RT) R17.1
N$54: IC8.7(SS) R77.1
N$55 [HV]: IC8.5(EN) JP1.2 R22.2
N$56: Q2.4(-B:S) R105.1
N$57 [HV]: C25.2 IC8.2(BOOST)
N$58: C68.2 Q2.2(-A:G) R87.2 R107.1
N$59 [HV]: L7.1 R108.1
N$60: R97.2 R98.1
N$61 [HV]: C38.1 R84.2 R85.1
N$62: R23.1 R49.2
N$63: C63.1 IC16.5(B:+IN) R98.2 R99.1
N$64: IC16.6(B:-IN) IC16.7(B:OUT) R100.2
N$65: C67.1 IC16.8(P:V+) R103.1
N$66: IC16.1(A:OUT) IC16.2(A:-IN) R101.2
N$67: C69.2 Q2.5(-B:G) R24.1 R65.2
N$68: IC10.3(OUT) R102.1
N$70: C40.1 R90.1 R91.1
N$73: C70.2 Q1.5(-B:G) R75.1 R82.2
N$74 [HV]: L8.1 R109.1
N$76 [HV]: J9.2 R110.1 R114.1
N$77 [HV]: C73.- C74.2 R116.2 R117.1 R122.2 R123.1
N$78 [HV]: C71.- C72.2 R110.2 R111.1 R114.2 R115.1
N$79: Q3.6(-A:D) R111.2 R115.2
N$80: Q3.2(-A:G) R112.1 R113.1
N$81: Q14.6(-A:D) R117.2 R123.2
N$83: Q14.2(-A:G) R118.1 R119.1
N$85 [HV]: C85.1 D6.A IC15.4 J12.1_+5V(+5V) R128.1
N$87 [HV]: JP1.1 R21.1
NC-A15-2: IC1.42(AN13/RB13)
OE-SRAM: IC1.82(RPD5/PMRD/RD5) IC2.28(!OE) R3.1
OUT+3.3V [GND]: C26.1 C30.1 C31.+ D2.+(C) IC8.1(BD) L9.2 R20.1 R129.2
PCLK: IC1.76(AN24/RPD1/RD1) J1.17 J2.17 O35.P$1(TP) T17.P$1(TP)
PGC: IC1.24(PGEC1/AN1/RPB1/CTED12/RB1) J17.5 R131.1
PGD: IC1.25(PGED1/AN0/RPB0/RB0) J17.4 R130.2
POWER-GOOD: IC6.4(OUT) R130.1 T45.P$1(TP) TP2.P$1(TP)
PWDN-CAM1: IC1.97(TRD0/RG13) J1.8 O22.P$1(TP) R12.1 T20.P$1(TP)
PWDN-CAM2: IC1.39(RPF13/RF13) J2.8 O18.P$1(TP) R16.1 T21.P$1(TP)
REF2,5V: C57.1 IC1.29(VREF+/CVREF+/PMA6/RA10) IC13.2(VOUT)
REF-EN: IC1.28(VREF-/CVREF-/PMA7/RA9) R93.1
RESET-CAM1: C76.1 J1.6 R11.1
RESET-CAM2: C75.1 J2.6 R15.1
SCL1-EEPROM: IC1.66(SCL1/RPA14/RA14) IC7.6(SCL) IC11.6(SCL) R26.2
SCLK2-SPI: IC1.10(AN16/C1IND/RPG6/SCK2/PMA5/RG6) IC9.6(C) J11.5(CLK) J15.12
SD-CS: IC1.9(RPC4/CTED7/RC4) J11.2(CS/DAT3) O5.P$1(TP) R127.2 T29.P$1(TP)
SDA1-EEPROM: IC1.67(SDA1/RPA15/RA15) IC7.5(SDA) IC11.5(SDA) R27.2
SDI2-MISO: IC1.22(PGED3/AN3/C2INA/RPB3/RB3) IC9.2(Q) J11.7(DO/DAT0) J15.11 O13.P$1(TP) T22.P$1(TP)
SDO2-MOSI: IC1.20(AN5/C1INA/RPB5/RB5) IC9.5(D) J11.3(DI/CMD) J15.14 O12.P$1(TP) T23.P$1(TP)
SIO-C-CAM: IC1.58(SCL2/RA2) J1.5 J2.5 R13.1
SIO-D-CAM: IC1.59(SDA2/RA3) J1.3 J2.3 R14.1
VBAT [HV]: C22.1 C23.1 C42.1 C43.1 C44.1 C45.1 C83.1 C84.1 IC8.4(VIN) IC10.4(VIN-) J5.5 J6.5 J7.1 J8.1 JP1.3 Q6.2(-B:S) Q6.5(-A:S) Q8.2(-B:S) Q8.5(-A:S) R22.1 R33.2 R39.1 R50.1 R55.1 R56.1 R61.1 R124.1 R125.1
VBAT-LAN [HV]: D3.C J3.1 J3.3 J4.1 J4.3 L11.2
VBAT-LAN-F [HV]: C33.1 C34.1 D6.K L11.1 Q5.2(-B:S) Q5.5(-A:S) R36.2 R38.2 R42.1 R45.1 R94.1 R132.1
VBAT-ON: IC1.52(RPF2/RF2) O42.P$1(TP) Q4.2(-A:G) R41.1 R132.2 T5.P$1(TP)
VBAT-SENSE: C64.1 IC1.26(PGEC2/AN6/RPB6/RB6) O15.P$1(TP) R100.1 T37.P$1(TP)
VBATLAN-SENSE: C36.1 IC1.27(PGED2/AN7/RPB7/CTED3/RB7) O16.P$1(TP) R101.1 T38.P$1(TP)
VBUS: IC1.54(VBUS) R128.2
VCAP: C53.1 C54.+ IC1.85(VCAP)
VPS-ON: IC1.53(RPF8/RF8) O41.P$1(TP) Q4.5(-B:G) R44.1 T7.P$1(TP)
VPS-PWR [HV]: D4.C J3.6 J4.6 L10.2
VPS-PWR-F: L10.1 Q5.4(-B:D) R23.2
VPS-SENSE: C65.1 IC1.12(AN18/C2IND/RPG8/PMA3/RG8) O7.P$1(TP) R48.2 R49.1 T3.P$1(TP)
VSYNC: IC1.8(RPC3/RC3) J1.7 J2.7 O4.P$1(TP) T19.P$1(TP)
WAKE-SW: IC1.72(RPD0/INT0/RD0) J14.5 O38.P$1(TP) T42.P$1(TP)
WE-SRAM: IC1.81(RPD4/PMWR/RD4) IC2.11(!WE) R4.1
XCLK1: IC1.7(RPC2/RC2) J1.13 J2.13 O3.P$1(TP) T16.P$1(TP)
Y2: IC1.68(RPD8/RTCC/RD8) J1.19 J2.19
Y3: IC1.69(RPD9/RD9) J1.21 J2.21
Y4: IC1.70(RPD10/SCK1/PMCS2/RD10) J1.22 J2.22
Y5: IC1.71(RPD11/PMCS1/RD11) J1.20 J2.20
Y6: IC1.79(RPD12/PMD12/RD12) J1.18 J2.18
Y7: IC1.80(PMD13/RD13) J1.16 J2.16
Y8: IC1.47(RPD14/RD14) J1.14 J2.14
Y9: IC1.48(RPD15/RD15) J1.12 J2.12
Unconnected: IC2.10(NC) IC2.13(NC1) IC2.30(D8) IC2.32(D9) IC2.34(D10) IC2.36(D11) IC2.39(D12) IC2.41(D13) IC2.43(D14) IC8.9(PG) J1.1 J1.23 J1.24 J1.C1(PAD1:CASE) J1.C2(PAD2:CASE) J2.1 J2.23 J2.24 J2.C1(PAD1:CASE) J2.C2(PAD2:CASE) J5.6 J6.6 J11.1(DAT2) J11.8(DAT1) J14.8 J15.2 J15.4 J15.5 J15.6 J15.7 J15.10 J15.15 J15.16 Q3.3(-B:D) Q3.4(-B:S) Q3.5(-B:G) Q14.3(-B:D) Q14.4(-B:S) Q14.5(-B:G)

## Buses
D[0..7]

## Notes on the sheet
- POZNAMKY:
- 18.1.2017
  to měření mikroproud pres odpory 1k je kravina
  chce to zmenit az co na to rekne Petr
  bud pridat dalsi MAX9938HEUK+T 
  a nebo udelat prepinani rozsahu
  za spinaci P-FET Q5-A dat do serie odpor 0,025R
  pres toto pripojit delic 2,5R-1k
  MAX9xx pripojit na odpor 2,5R v dilici 1k 2,5R 
  a pridat pomocni P-FET co spoji uzel 2,5R-1k
  s uzlem 0,025R-Q5A a tento voladat spolecne s Q5A
- 18.1.2017
  lze uvolnit RB13 alternativni adresni A15-2
- 18.1.2017
  R108 R109 na prvnich kusech je 10R
  na linkach +A -B na RS485
  zvazit jestli to nezmenit 10R->1R->0R
- CHYBY: | UDELANO, OPRAVENO:
- 18.1.2017
  Q5A+Q5B  FDC6506P by mohl být slabý
  pro zapínání napájení 
  v připadě zkratu by asi odesel driv nez pojistka
- 12/2017 opraven konektor pro latch male dirky
  18.1.17
  vyhodil jsem test pointy u diody D6 - +5VUSB->VBAT
  opraveno přehození D+ D- na USB
  24.1.17 opraveny tantaly (polarizovane pouzdro)
  nahrazen USB-A-90 za USB-B-90
- Chce se pouzit 4 clankovy LiFEPO nominal 12,8V (4x3.2) bezne nabijeni max. 14,8V (4x3.7V) pocatecni iniciacini napijeni 16,0 nebo 16,8 (4x 4,0 nebo 4.2V) vrcho je tedy stejny jako u Lion
- Transil P6SMB16A standoff 13.6V  breakdown 15.2-16.8V/1mA  max power 22.5V/27A - NELZE POUZIT s 4 clankovym LIFEPO
- Transil P6SMB20A standoff 17.1V  breakdown 19-21V/1mA  max power 27,7V/22A
- 9 pins for eLatch
- magneticky spinac na stavajicim eLock latchi je kupodivu NC normaly closed a priblizenim magnetu se rozpoji
- Southco R4-EM electromechanical rotary lock:
- 1 - GND
- dle DSH A,B funguji v rozsahu +12V/-7V, RS486 terminator 110R, differ. imp 54R 50pF
- 2 - power 7-24V max. 650mA, standby 58uA, 500+300ms | dle DSH maji A, B vstupni odpor 180k do zdroje 1,6V s impedanci 18k (delic 36k/36k)
- pin3 goes  HI: 650mA 3ms, 250mA 30ms, 250->60mA 60ms, 60-80mA 400ms, then 8mA until pin3 is HI | diferencialni odpor mezi A-B je tedy cca 400k to odpovídá změřeným 0,42V s 3x1M
- pin3 goes LO: 650mA 3ms, 250mA 30ms, 250->60mA 60ms, 60-80mA 200ms, then 58uA until pin3 is LOW | dle mereni pri tomto zapojeni A,B na delic 1M-1M-1M je v klidu diferencni napeti 0,42V
- power must be ON minimum 300ms after pin3(control signal) goes LOW | na A=2,01V na B=1,59V pri VCC=3,30V
- lock working and input current are same in range 7-24V, under 7V goes slower, under 5,2V not working | dle mereni spotreba 4,4mA - kdyz /RE=DE=0 je aktivni, nebudi linku a posloucha R=3,3V A>B R=0V A<B
- dle mereni spotreba 9,3mA - kdyz /RE=DE=1 je aktivni a budi linku A/B podle D
- 3 - control signal, input imp. 6,2k, HI level >2,8V | spojeni /RE a DE je pekna prasarnicka dle DSH je jeden pull up 100k a druhy pull down 100k
- pri mereni zjistuji napeti 0,84V - oh shit nedefin 0.8-2.0V, 100k k GND 0,45V, 100k na +3,3V 2,32V
- 4 - COM common contact (mechanic switch inside lock) | spojeni /RE a DE ma impedanci cca 90k-150k -> pull down <20k, napeti je 0,84V a chova se to jako low ale je to nespolehlive!
- kdyz /RE=0 a B<A tak R=3.3V imp cca 30R,  kdyz /RE=1 tak R je Hiz je vhodne pull up
- 5 - NO normally open contact, closed if lock closed | dle mereni je D pullupovane cca 90-150k - neni nutny ext. pull up, kdyz D=1 tak B=0V a A=3,3V
- 6 - NC normally closed contact, open if lock closed
- O
- L2CTL tOFF=2.2ms | I
- L2CTl tON=0.50ms
- L2CT ON dU/dt=8V/100us
- L2PWR tOFF=125ms
- L2PWR tON=25ms
- L2PWR ON dU/dt=1,6V/ms 220uF->350mA
- propojit pro jiny typ zamku
- ktery ma v sobe
- druhy spinac - dverni
- VBAT if door close
- open if door open
- VBAT if lock close
- open if lock open
- Unom=13V
- Inom=2,2mA
- USB+5V
- Imax=43mA
- tau=30us
- VBAT nom = 12.8V
- <- 2.2mA
- tdisch=0,7ms
- Ugs 0,9V @ 2mA
- 1,4nC/3,3V | 1,4nC/3,3V
- 200-400pF | 200-400pF
- Ugs 0,7V @ 30uA
- PWM OCx | PWM OCx
- R132 zapojen pred Q5A 
  na vzorcich vc1-4 je R132 za Q5-A 
  a nefunguje to optimalne
- <-4,3-6,5uA/13V
- VPS-SENSE dat na AN+RP
- VBAT if door close
- open if door open | <-1uA
- <-2.5uA
- <-2.5uA
- VBAT if lock close
- open if lock open | tau=0,56ms
- stabilization <0,1% 0,8ms | tau=0,5ms  1n/0,5M
- kond u PICA
- tau=0,11ms
- <-3.3uA/3.3V
- <-8,7uA/2,6V | Ugs=0,64V
- <-3.3uA/3.3V
- <-8,7uA/2,6V
- 2,5V@1A (0,025R)
- C66 near PIC
- merici krok na ADC 25,0mV
- rozsah do 25,6V ->2,50V
- ratio 1:100   supply curr 1uA  out imp 10k
- C63 R99 R98 must be near IC16B
- stabilization  <0,1% 5ms
- C62 R96 R95 must be near IC16B
- tau=0,22ms
- C36 near PIC
- 1M/100nF/300k:
- C64 near PIC
- tONtime=50ms rise time 20ms  max.dU/dt=0,5V/1ms max. curr. 0,5A @ 1000uF
- na PICovi je 44 mapovatelnych volnych I/O portu z toho 11 bez funkce RPxxx (tedy prioritne namapovat jako OUT) | tOFFtime=150ms  fall time 50ms
- Vyzkouset funkci EN pri 6V a pokud nebude potreba | pri REF = 2,5V je merici rozasah do 25,58V => 2,50V na ADin
- FDG6303N   IDS/UGS 1-10uA/0,6-0,7V ISD<0,2uA/0,55V 90pA/0V 2,1nA/0,23V 220nA/0,55V  8uA/0,66V
- Petr chce BT z +3.3V | z techto 44 I/O jsem nechtel 2 pouzit (pin 21 a 51, O43 a O44) protoze maji funkci s USB, ktera se aktualne nepouziva | tak R21 odstranit a spoji JP1 2-3
- delici pomer 1 : 0,09757 a mereny dilek 25,0mV (24,98mV)
- SSM6P49NU  IGS/UGS  9,5nA/3,5V  20nA/5V 0,2uA/10V
- JP1  1-2  IC8 startuje pri 5,8-6,0V a to hnusne - je to nanic, mala hyst pokmitava v 5,8-6,0V | SSM6P49NU  IDS=0,1-1A/UGS=1,2-1,3V/UDS=3-15V
- JP1  2-3   IC8 startuje pry pri  4,3V (dle DSH) ale | SSM6P49NU  RDSON=0,08/UGS=1,8V(max. by DSH 0,15)    RDSON=0,06/UGS=2,5V(max. by DSH 0,08)
- IDS 0,01->1A / UGS=1.2->1.3V
- Bluetooth modul | IC8 funguje uz pri 3,8V (zmereno) dava 3,2V
- IDS 150uA / UGS=0.68V
- extention | na USB J12 musi byt 4,2V pro napajeni z USB
- deska potrebuje 46 I/O - 21 OUT, 3AN, 1RP+AN, 21 RP (RP pro input nebo HW funkce) | IC1 (PIC) funguje od 2,2V (zmereno)
- zatez 10uF na desce | 2 signaly POWERGOOD a  /PRESENT se pripoji k PICovi přes 100k na PGC a PGD
- SRAM,2xEEPROM,LATCHe 0,5uA
- tedy nema smysl vypinat | PGC a PGD jsou podminene jako inputy
- spinani 100us pri 10uF+22R zatezi | THR=1.0V
- max. dU/dT=1V/30us na 10uF => 300mA
- INTx
- 1.19V
- BT by melo byt v bottomu, nejmene tedy dat konektor 1x8pin, montazni otvor pro M3 se zrejme nevejde
- BT ma 5 I/O, TX a RX nutne na RPxx I/O, WAKE a RTS na OUT, CON_LED je IN na RPxx | 835kHz
- zatez 47uF na desce
- FLASH 10uA VPS 10uA
- JEN VYPOCTY - NEOVERENO!
- spinani 700us pri 90uF+22R | utlum 100R 20uF  RC=2ms
- tlumivka 3.3uH je jen pro pocit
- starup 0V->3,25V(-0,05V) 10ms
- 60dB s 20uF udela az na 0,8Mhz
- max. dU/dT=1V/200us na 47uF =>230mA | 7dB@100Hz
- a vyznamnejsi nez 100R se stava az nad 10Mhz
- 22dB@1kHz
- pokud R<3R pak 3uH a 20uF staci pri >500kBps | 42dB@10kHz
- R>=1R zachovat vzdy! | 62dB@100kHz
- Udaje o PSRR ADC PIC nejsou
- Melo by byt >60dB@100Hz >40dB@1kHz a >0dB@100kHz
- 20uF pri odberu 5mA udrzi 10us pokles napeti pod 1:1000 (60dB)
- 20uF s L=3,3uH 1R<R<3R 60dB pro 800kHz
- 4,5mV | RC 10R 20uF = 200us overeno merenim
- zatez 10uF na desce
- spinani 100us pri 10uF
- max. dU/dT=1V/30us na 10uF => 300mA | 0,45mA | VPS a FLASKA musi byt na stejnem SPI, mit spolecne napajeni a sdilet SCLK2, protoze  SCLK1 je obsazen  (70/RD10/PMCS2)
- IC12 RS485 odber cca 5mA
- AVDD max. +/-0.3V od VDD
- J8 - VPS connector is electrically compatible with LAN Adapter connector on MB5.x
- added EMI choke
- p | o | UxTX
- I in ->
- 0.1uF->1uF
- i | i | UxRX
- zatez 90uF na desce | o | o | UxCTL
- CN,INT3 | VBAT | p | o
- IC5 TLV73315  odber cca 40uA
- PWM OCx
- 6-27Mhz | PWM OC1 | p | p | 3.3V
- spinani 700us pri 90uF+22R | added EMI choke
- CN,INT2 | i | o
- max. dU/dT=1V/200us na 90uF => 450mA | R8 prodluzuje zapinani omezuje spickovy proud <3A
- V datshitu DS60001185F-page 318 je uvedeno,
  ze AN15-AN27 jsou na hovno....  pice...
  CURR-SENSE je na AN19
  asi by slo prohodit s /3.3V1PWRON
- R8 umoznuje zmerit proud do kamer
- o | o
- added 1000uF
- SDA | io | o | SCL
- OC4 | PWM OCx | POZOR nezapojeno
- INT3,AN18 | CN,INT3 | U2TX | IC7 power consuption =  22uA + 19% I in
- FLASH SPI SO08(150mil) 32Mb
- efficiency 81% *  ( Iin -27uA) / I in
- MB v5.91 M25P16-VMN6P - obsolete
- U2RX
- MB v5.92  N25Q032A13ESC  obsolete
- 6.6.2017 found:
- AN19 | U2TX | U2CTL
- AT25SF321-SSHD
- MX25R3235FM1IH0
- SD karta je v BOTTOMu | IS25LQ032B-JNLE
- Power Consuption | SD karta je jen pro vyvojove ucely
- 1.6.2015 v5.9  pridat RC FILTR 1R/2x47uF  a DC vazba je az R84
- LOCK2IN
- 50mA/100Mhz | bezne by se nemela osazovat | otestovalo se to a zda se to dobre
- neni RP->
- DOOR2IN
- RESET-CAM2 nezapojovat na PIC, jen pull up | 5mA/10Mhz
- neni RP->
- INT2
- 0,1mA/31kHz LPRC
- pokud mozno
- neobsazovat USB
- RESET-CAM1 nezapojovat na PIC, jen pull up
- INTx
- INT4 | BT-RTS
- WAKEUP
- CN,INT3 | CON-LED
- INTx
- INT1
- DMA CLK
- AN6 | AN6
- ZAPOJENO pres 100k na PGC
- AN7 | U3TX | WAKE-SW
- tlumivka do serie s 300R nema smysl
- U3RX | BT-TX
- aby se projevila na 100kHz a vic muse by byt 100uH
- BT-RX
- utlum 300R 0,2uF  RC=0,06ms | Pri napajeni z USB spojit na JP1  2-3 !!!
- starup 0V->2,7V 1ms | REF3025
- 1dB@100Hz | PSRR 65dB@100Hz | 0,22mA | Z USB pres diodu mozna step down uz nemusi fungovat
- 3dB@1kHz | PSRR 45dB@1kHz | blokuje SCK1
- 11dB@10kHz | PSRR 25dB@10kHz | a tim celou SPI1 | pak propojit dratkem  TP5 a J3/1 (RJ45)
- 31dB@100kHz | PSRR 5dB@100kHz
- 66mV
- 300R 0,2uF+ REF3025 30-40dB -> odfiltruje AC az +/-0.1V -> +/-1mV na 2.5V | spojovat TP5 a TP6 natrvdo je riskantni, protoze se zapomene
- prechodovy dej po velke zmene odberu 0->5mA | a pripoji se baterka 13V na LAN a tim na USB +5V a zhori USB na PC
- DMA | se zatezi 0,1-1uF dozni po max. 100us dle DSH
- RC 300R 200nF cca 60us overeno merenim
- START
- prechodovy pri ADON,REFEN=0->1 cca 250us
- Iquesc=42uA
- tzn. pri odberu cca 0,22mA
- DMA
- START
- vlastni odber 40uA (zmereno)
- TP1 musi byt pristupny pri testovani desky
- Doba ustaleni 2.5V je  250us (zmereno) se zatezi 0,22mA (ADC ON)
- PWM
- 6-27Mhz | PWM OC5
- byla to alternativni A15-2
- Camera OV9712
- DMA
- neobsazovat USB
- CLK | Power down 50uA max. 100uA | Prohozeni D+ a D- jiz opraveno
- neobsazovat USB
- LDO 1.5V 0.3A stable with ceramic cap | Cam not operating, I2C active 250uA max. 600uA | Zmenil jsem USB-A-90 na USB-B-90
- Operating 36mA max. 54mA total from 3,3V
- neobsazovat USB
- from that 6mA max. 10mA thru 1,5V LDO
- CN,INT3
- na procesor jsou zatim zapojene pouze Y2-Y9
- CN,INT4
- pokud mozno neobsazovat USB
- Poznamky pro pripadny dvojite USB s napajenim:
- 1) Na PICovi vystupy D+/D- (RG2/RG3) a vstup VBUS a sprvane zapojit napajeni VUSB3V
- 2) Prepinac 1USB na 2USB TS3USB221, je udelany ACB.lbr, 1-2 vystupu: volba kanalu, prip OE USB
- DMA INTx | 3) 2x ESD ochrana TPD2E001, pouzit na LAN-RS485, pouzdro jako SR3.3 semtech.lbr
- START | 4) 2x konektor USB udelan v ACB.lbr a na nej je potřeba 2x 5V/0,5A
- 5) Zdroj 5V/0.5A bud druhy LT3971EMSE +5V z VBAT zapinatelny (1 vystup)
- nebo zde pouzity co dela 3.3V zmenit na 5V a za nej lin.stab na 3.3V TLV73333 3.3V/0.3A
- DMA INTx | a pripadne tento 5V udelat prepinatelny na 3,6V kdyz se nepouziva USB, aby se zvysila ucinnost (2vystupy)
- START | eventulne by slo prepina na 3,3V a lin stab vyblokovavat coz je nebezpecne (3vystupy) a nema moc smysl
- Ještě je otázka jestli by TLV73333 s maximem 0,3A stačilo na všechno na 3,3V (PIC 50mA kamera? VPS? RS485 10-30mA)
- 6) 2x zapinač napajení tzn. 2x P-FET ovladany z PICa - 2 vystupy
- DMA INTx | Pro potřeby USB zabrat vyhradit a neobsadit RG2,RG3, VBUS
- CLK | Pro potřeby ovladani max. 6 vystupu, EN zdroje a OE USB prepinace lze spojit
- lze spojit volic kanalů a jeden gate tranzisdoru zapinajiho +5V (tim padem 4 vystupy)
- pridanim N-FETu se na signal volby kanalu by stento mohl ovlada P-fef +5V (jen 3vystupy)
- PWM OCx
- 6-27Mhz
- pull down na LE neni bezpodminecne nutne
- PROJIT SI znovu CS, 15 a 16 bit adresovani atd
- THRon=12.5V
- THRoff=10,6V
- ZAPOJENO pres odpor 100k na PGD
- pull up na WE a OE neni bezpodminecne nutne
- musi byt pohromade
- neni zapojen CS-SRAM
- pull up na CS2 musi byt
- SRAM 16Mb 2Mx8 v TSOP-I 48
- R1LV1616RSA-5SI
- R1LV1616HSA
- RMLV1616AGSA-5S2
- CY62167
- AS7C316096

## Library data of the parts
C1-C8 C15 C18 C19 C21 C24-C28 C32-C53 C55 C57-C70 C72 C74-C80 C82 C85 C88 = DISCRETE:C-0603
C9-C14 C16 C17 C20 C54 C56 C86 C87 = DISCRETE:CT-1206
C22 C23 C29 C30 = DISCRETE:C-1206: Capacitor 1206
C31 C71 C73 C81 = SmdDisc:CT
C83 C84 = SMD-ELYT:CAP-ELEC-SMD
D2 = st-microelectronics-AOM:SMLVT3V3: TVS 600W 4.1 Breakdown
D3 D4 = Littelfuse:P6SMB: P6SMB20A TVS Unidirectional 17.1V 1uA, 19.0-21.0V@1mA breakdown, 27.7V@22A P6SMB16A TVS Unidirectional 13.6V 1uA, 15.2-16.8V@1mA breakdown, 22.5V@27A
D5 = DISCRETE:LED-0805
D6 D7 = SmdDisc:DS: Diody schotki: 1) BAT48 MELF1406 signalova 40V 0,3V/10mA 0,5V/0,2A 30pF,10pF/5V 3uA/50°C 2) SS14 SMA power 40V 0,2V/10mA 0,4V/1A 300pF,60pF/20V 200uA/75°C
F1 = ArdDisp:POJISTKA: Pojistka 1) klasicka 5x20 ve vyvodovem pouzdru KS20SW 2) SMD 2410 (6x2,6mm) v pouzdru Littlefuse 0154
H1 H2 = ACB:CAM-HOLDER
IC1 = ACB:PIC32MX470F512L: Jara 6.6.2017 sym, pac12x12 a pac 14x14 a zapojeni dev importovano z PIC32MX470F512L-80I_PF.bxl ...._PT.bxl
IC2 = ACB:R1LV1616
IC3 IC4 = ACB:74LVC573
IC5 = ACB:TLV73315PD: Texas LDO 1.5V 0.3A Vin=5.5V drop=0.125V@0,3A, stable with ceramic, stable without capacitor, Iques 34uA, output curlim 350-450mA with foldback
IC6 = ArdDisp:MIC841: Comparator intREF 1,24V 1,5-5,5V 1,5uA hyst-set-by-Rdiv (2x comp+RS), speed 15us/100mV 80us/10mV, types: MIC841Lxx push-pull if HTH>ref then low, MIC841Hxx push-pull if HTH>ref then high, MIC841Nxx open drain if HTH>ref then high imp
IC7 IC11 = Microchip-AON:24*: Serial EEPROM I2C
IC8 = ACB:LT3971: LT3971 38V, 1.2A, 2MHz Step-Down Regulator with 2.8μA Quiescent Current 5,6$ ext P-ch curr lim const on time http://cds.linear.com/docs/en/datasheet/3971fd.pdf Hořa 7.6.2017
IC9 = Micron-U:M25P16: 16Mbit low voltage SPI Flash
IC10 = Touchstone-U:TSM9938: IC OPAMP CURRENT SENSE SOT23-5
IC12 = TexasInstruments-AON:SN65HVD3082E: RS-422/485 TRX 1RX 1TX
IC13 = ACB:REF3025: REF3025 2.5V 0,2% 42uA Hora
IC14 IC15 = Semtech-AOM:SR05: IC TVS ARRAY 2-LINE 5V SOT-143
IC16 = Microchip-AON:MCP6042: OAMP 14kHz LowPower 0,6uA G=1 stable OutCapLoad 70p/50k 10n/10k RailToRail VSS+0,4V VDD-0,5V
J1 J2 = CON-Hirose-AON:FH12A-24S-0.5SH: Flat cable connector 0.5mm Pitch TOP Contact Type Jara 3.9.17 z 24pinoveho BOTTOM
J3 J4 = ACB:RJ8-8
J5 J6 = ACB:MOLEX430450613: Micro-Fit 3.0 Vertical Header 2x3 http://www.molex.com/molex/products/datasheet.jsp?part=active/0430450613_PCB_HEADERS.xml Hořa 7.6.2017
J7-J10 = Tyco-U:3-641215-2: header 2 pin 100mil spacing
J11 = CON-Hirose-AON:DM3AT: SD Card connector/holder
J12 = ACB:USB: USB connector Type A Copy from TTSKK and redesign. Hořa 10.6.2017
J14 = CON-pinHeader-AON:MA08-1: Lita 8x1 Female 609-3589-ND (Digi-key) Male Jakýkoliv obyèejný 2,54mm konektor Hoøa 13.11.2016
J15 = CON-pinHeader-AON:MA08-2
J17 = CON-pinHeader-AON:MA05-1
JP1 = SmdDisc:JP3CLOSE12
L1-L8 L10-L13 = DISCRETE:L-1206
L9 = Sumida-UT:NR6028: NR6028, NRS6028 6x6x2,5mm, NR6045, NRS6045 6x6x4,5mm
O1 O9 O17 O22-O26 O31 O32 O39 O40 O44 T1 T2 T4-T8 T15 T20 T21 T25-T33 T36 T42 T44 = TESTPAD:PIC-OUT: Docasna soucastka na smerovani wire k procesoru bez pripojeni k procesoru
O2-O8 O10-O16 O18-O21 O27-O30 O33-O38 O41-O43 T3 T9-T14 T16-T19 T22-T24 T34 T35 T40 T41 T43 T45 T46 = TESTPAD:PIC-RPX: Docasna soucastka na smerovani wire k procesoru bez pripojeni k procesoru
PCB1 = ACB:PCB-ACB
PCB2 = ACB:PCB-VPS
PCB3 = BT_modul:BT_PCB
Q1 Q2 = Toshiba-AON:SSM6P49: MOSFET P-CH DUAL 30V UDFN6, 4A, 20V
Q3 Q4 Q7 Q9-Q14 = Fairchild-AON:FDG6303N: Dual N-channel digital FET 25V/0.5A 0.45Ohm
Q5 Q6 Q8 = Fairchild-AON:FDC6506D: Dual P-Channel Logic Level PowerTrench MOSFET -1.8A, -30 V RDS(on) = 0.170 Ohm @ VGS = -10 V RDS(on) = 0.280 Ohm @ VGS = -4.5 V
R1-R7 R9-R34 R40-R103 R107-R119 R122-R132 = DISCRETE:R-0603
R8 R35-R39 R104-R106 = DISCRETE:R-0805
REF1 REF2 = technol:REF
T37-T39 = TESTPAD:PIN-AN: Docasna soucastka na smerovani wire k procesoru bez pripojeni k procesoru
TP1 TP2 TP4 = TESTPAD:ROUND_SMD: Generic round SMD testpad
X1 = TXC_Tech-U:XTAL

## Net classes
1 HV: clearance 0.3 mm to class 0